# EAGLE board 8BIT_LOGIC_2 (EAGLE 6.5.0), part 1 of 2
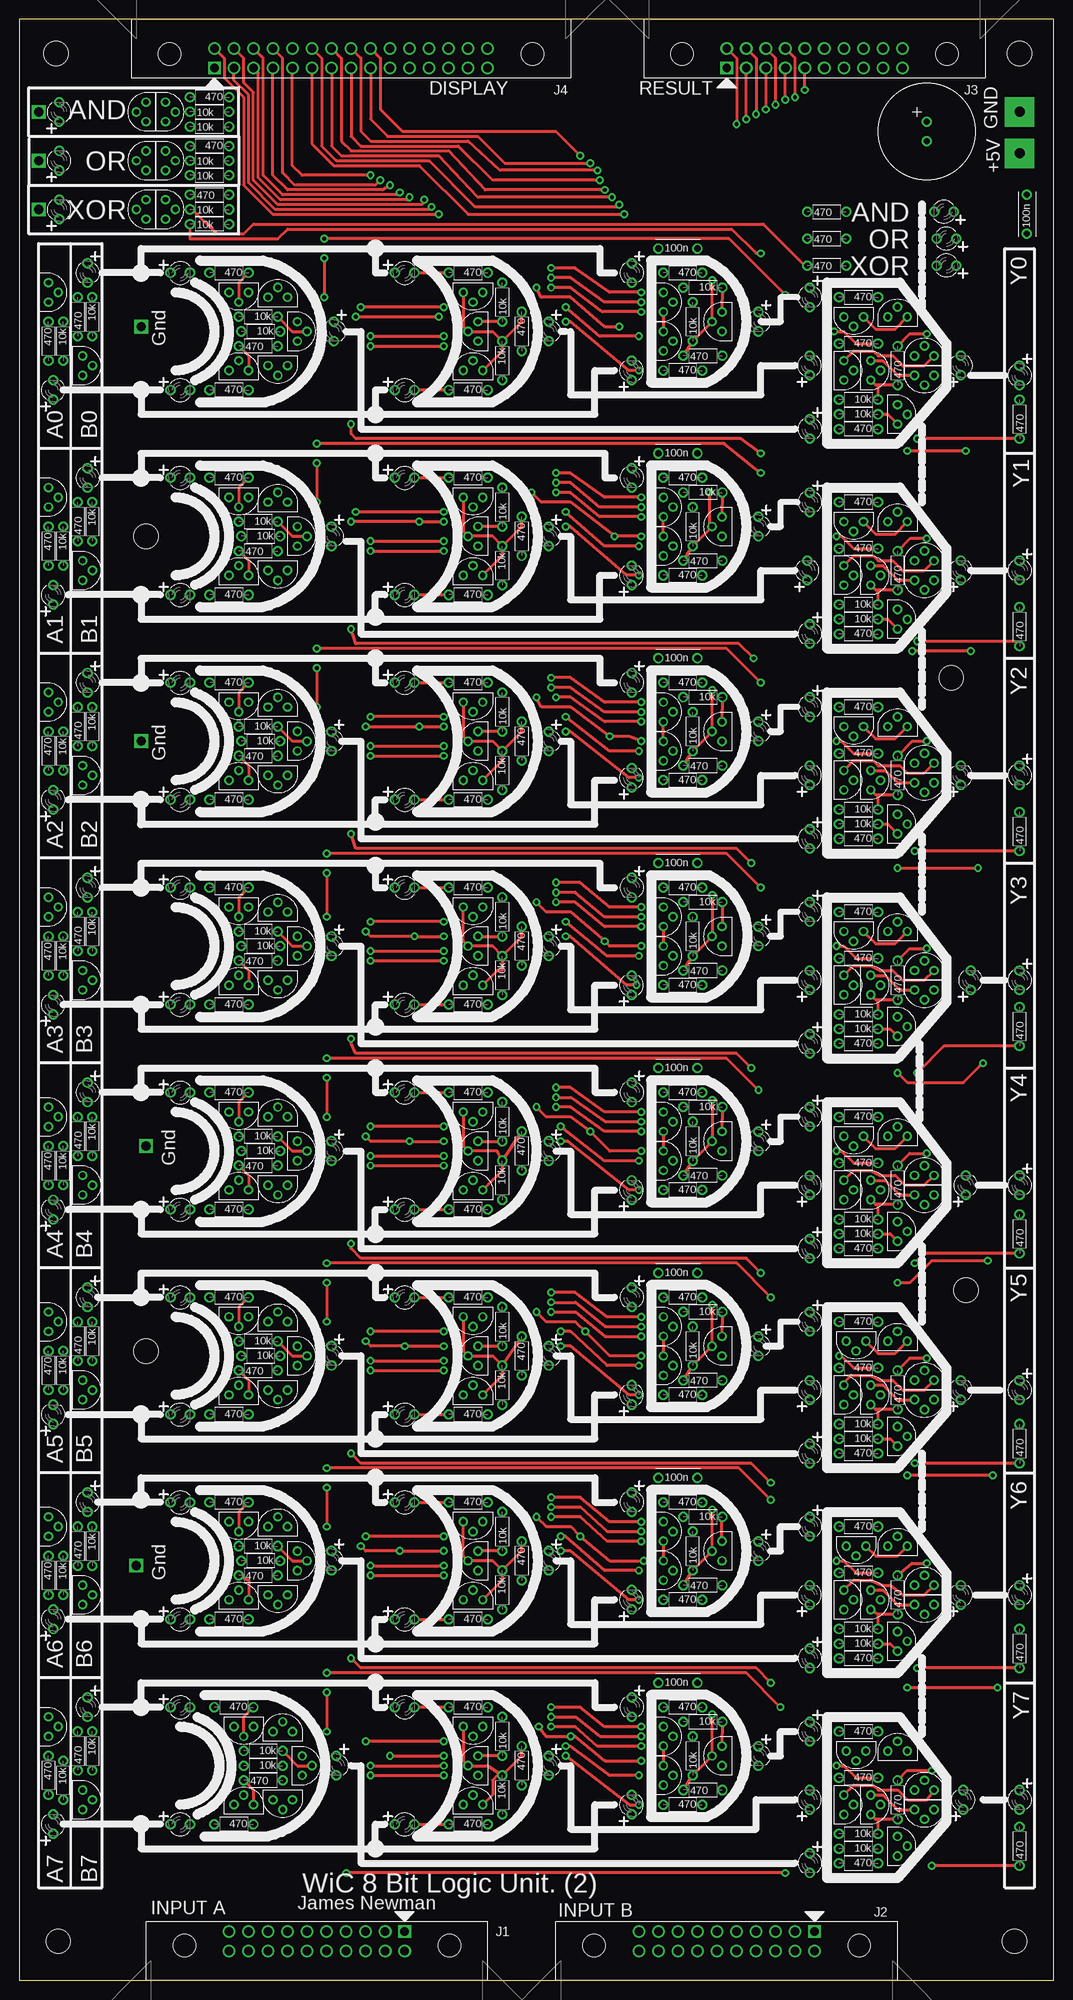
[diagram p16: board, top side]
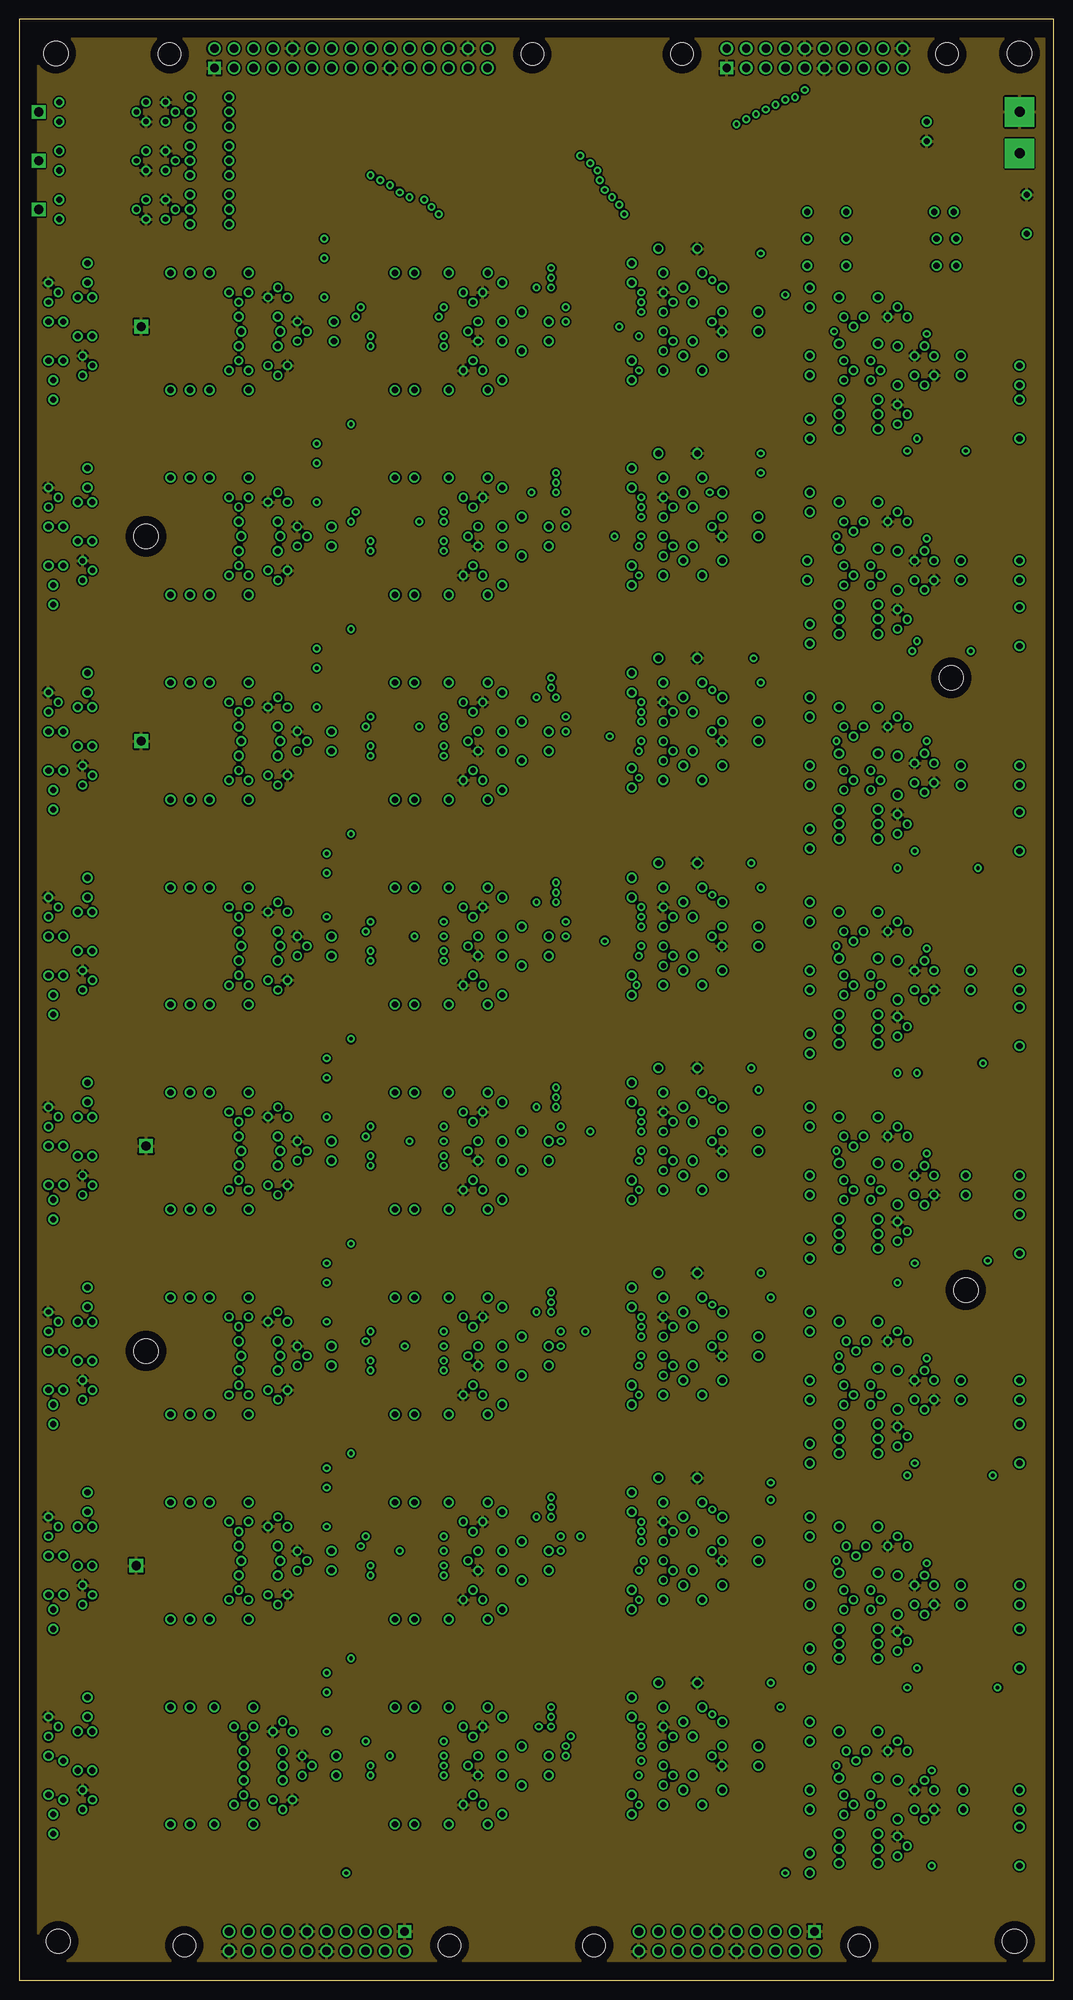
[diagram p17: board, inner layer Route2]
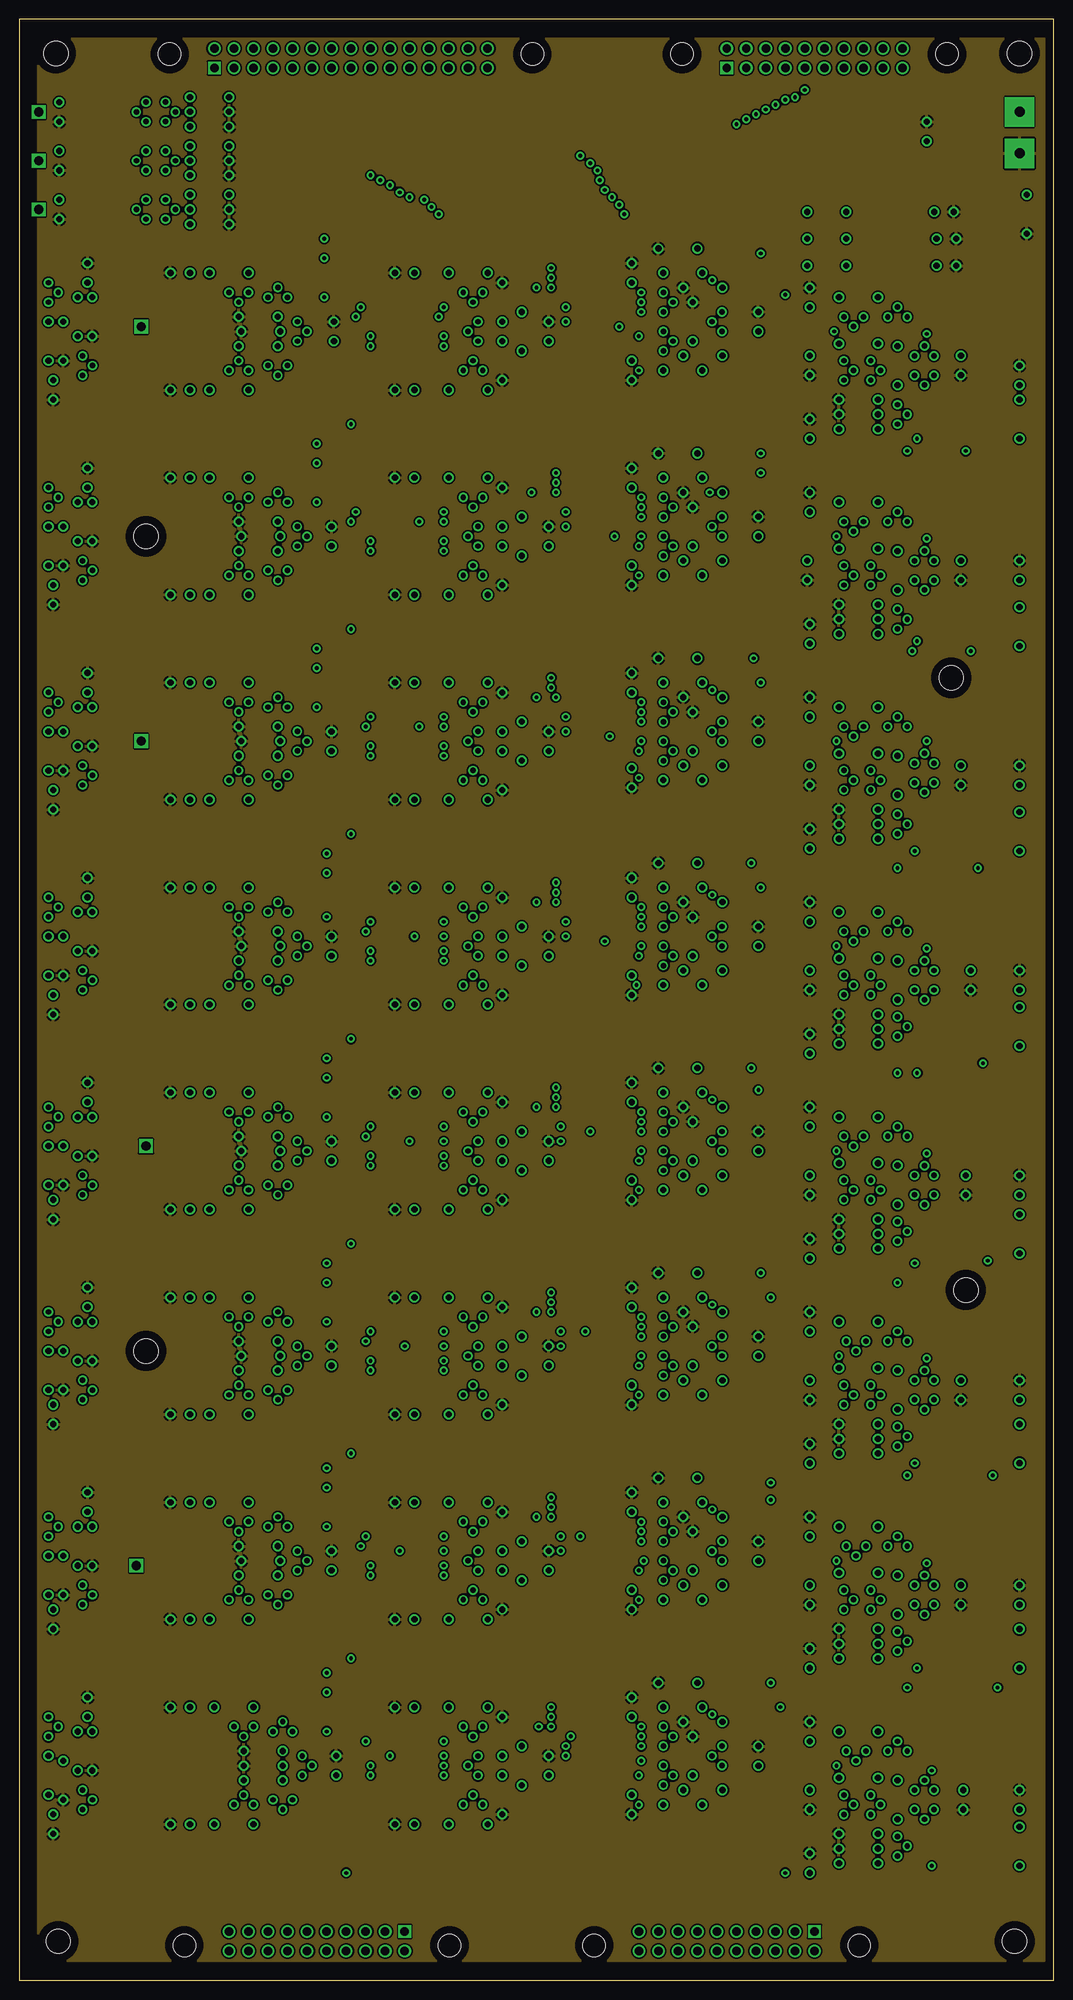
[diagram p18: board, inner layer Route3]
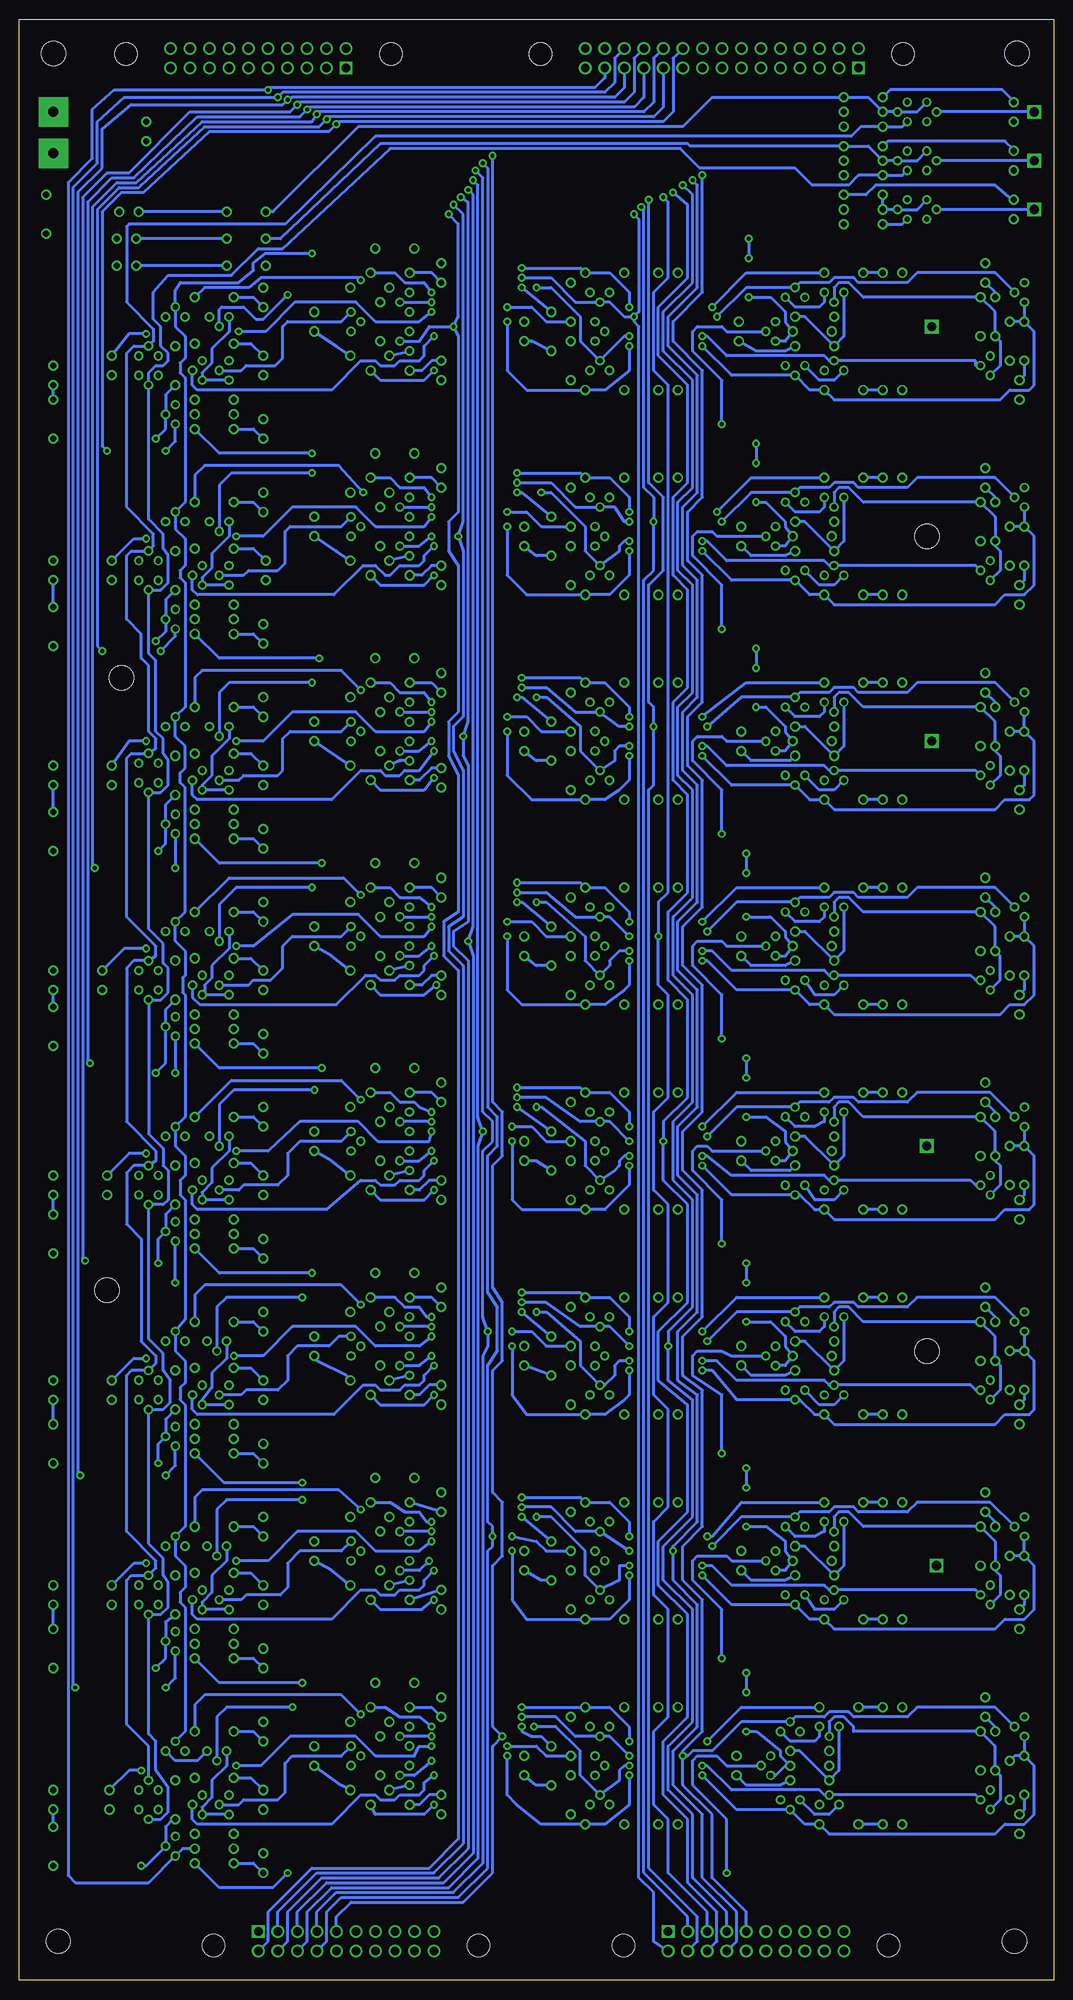
[diagram p19: board, bottom side, seen from below]

Size 134.62 x 255.27 mm. Coordinates in mm from the lower left corner, seen from the top.
Outline: 0,0 134.62,0 134.62,255.27 0,255.27 0,0
Copper layers (1*2+3*16): Top 0.035mm / dielectric 0.2mm / Route2 0.035mm / dielectric 1mm / Route3 0.035mm / dielectric 0.2mm / Bottom 0.035mm
Design rules "processor_rules_4layer": minimum track width 10mil, minimum drill 0.0236mm, track to track 8mil, track to pad 8mil, pad to pad 8mil, via to via 8mil, smd to smd 8mil, copper to edge 40mil, drill to drill 8mil, minimum pad ring 10mil, minimum via ring 8mil, stop-mask expansion 4mil, vias tented up to drill 0.7mm, thermal gap 10mil

## Footprints (pad centres in the part's own frame; a part is rotated, then mirrored left to right if it is on the bottom)
CAP_P2INCH = drill 0.8: 1 -2.54,0; 2 2.54,0
POLARISED_CAP_2P5 = drill 0.8: A 1.27,0; K -1.27,0
LED3MM = drill 0.8: A -1.27,0; K 1.27,0
3M_HOLE = hole 3.2: 0,0
20_HDR_LOCKING_RA = drill 1.1 square: 1 -11.43,-1.27 | drill 1.1: 2 -11.43,1.27; 3 -8.89,-1.27; 4 -8.89,1.27; 5 -6.35,-1.27; 6 -6.35,1.27; 7 -3.81,-1.27; 8 -3.81,1.27; 9 -1.27,-1.27; 10 -1.27,1.27; 11 1.27,-1.27; 12 1.27,1.27; 13 3.81,-1.27; 14 3.81,1.27; 15 6.35,-1.27; 16 6.35,1.27; 17 8.89,-1.27; 18 8.89,1.27; 19 11.43,-1.27; 20 11.43,1.27 | hole 2.946: -17.247,0.533; 17.247,0.533
30_HDR_LOCKING_RA = drill 1.1 square: 1 -17.78,-1.27 | drill 1.1: 2 -17.78,1.27; 3 -15.24,-1.27; 4 -15.24,1.27; 5 -12.7,-1.27; 6 -12.7,1.27; 7 -10.16,-1.27; 8 -10.16,1.27; 9 -7.62,-1.27; 10 -7.62,1.27; 11 -5.08,-1.27; 12 -5.08,1.27; 13 -2.54,-1.27; 14 -2.54,1.27; 15 0,-1.27; 16 0,1.27; 17 2.54,-1.27; 18 2.54,1.27; 19 5.08,-1.27; 20 5.08,1.27; 21 7.62,-1.27; 22 7.62,1.27; 23 10.16,-1.27; 24 10.16,1.27; 25 12.7,-1.27; 26 12.7,1.27; 27 15.24,-1.27; 28 15.24,1.27; 29 17.78,-1.27; 30 17.78,1.27 | hole 2.946: -23.597,0.533; 23.597,0.533
POWER_PAD = drill 1.3 pad 3.81 square: 1 0,0
TO92-DGS = drill 0.7: D 0,1.27; G -1.27,0; S 0,-1.27
R_P2INCH = drill 0.8: 1 -2.54,0; 2 2.54,0
TEST_LOOP = drill 1.2 square: P$1 0,0

## Placement (x,y rotation side)
C1  100n  [CAP_P2INCH]  131.13,229.87 90 top
C2  100n  [CAP_P2INCH]  85.72,225.43 0 top
C3  100n  [CAP_P2INCH]  85.72,145.41 0 top
C4  100n  [CAP_P2INCH]  85.72,65.41 0 top
C5  100n  [CAP_P2INCH]  85.72,38.73 0 top
C6  100uF  [POLARISED_CAP_2P5]  118.11,240.66 90 top
C7  100n  [CAP_P2INCH]  85.72,198.75 0 top
C8  100n  [CAP_P2INCH]  85.72,118.75 0 top
C9  100n  [CAP_P2INCH]  85.72,172.09 0 top
C10  100n  [CAP_P2INCH]  85.72,92.08 0 top
D1  L-1334SRT  [LED3MM]  5.21,243.21 90 top
D2  L-1334SRT  [LED3MM]  5.21,230.5 90 top
D3  L-1334SRT  [LED3MM]  5.21,236.85 90 top
D4  L-1334SRT  [LED3MM]  102.87,219.07 270 top
D5  L-1334SRT  [LED3MM]  102.87,192.41 270 top
D6  L-1334SRT  [LED3MM]  102.87,165.74 270 top
D7  L-1334SRT  [LED3MM]  102.87,139.06 270 top
D8  L-1334SRT  [LED3MM]  102.87,112.39 270 top
D9  L-1334SRT  [LED3MM]  102.87,85.72 270 top
D10  L-1334SRT  [LED3MM]  102.87,59.05 270 top
D11  L-1334SRT  [LED3MM]  102.87,32.38 270 top
D12  L-1334SRT  [LED3MM]  102.87,210.19 90 top
D13  L-1334SRT  [LED3MM]  102.55,183.51 90 top
D14  L-1334SRT  [LED3MM]  102.87,156.84 90 top
D15  L-1334SRT  [LED3MM]  102.87,130.18 90 top
D16  L-1334SRT  [LED3MM]  40.96,214.63 270 top
D17  L-1334SRT  [LED3MM]  20.95,222.25 0 top
D18  L-1334SRT  [LED3MM]  20.95,207.01 0 top
D19  L-1334SRT  [LED3MM]  102.87,103.5 90 top
D20  L-1334SRT  [LED3MM]  102.87,76.83 90 top
D21  L-1334SRT  [LED3MM]  102.87,50.16 90 top
D22  L-1334SRT  [LED3MM]  40.64,187.96 270 top
D23  L-1334SRT  [LED3MM]  20.95,195.58 0 top
D24  L-1334SRT  [LED3MM]  20.95,180.34 0 top
D25  L-1334SRT  [LED3MM]  102.87,23.5 90 top
D26  L-1334SRT  [LED3MM]  102.87,201.93 270 top
D27  L-1334SRT  [LED3MM]  102.87,175.26 270 top
D28  L-1334SRT  [LED3MM]  102.87,148.59 270 top
D29  L-1334SRT  [LED3MM]  102.87,121.92 270 top
D30  L-1334SRT  [LED3MM]  102.87,95.25 270 top
D31  L-1334SRT  [LED3MM]  68.9,214.63 270 top
D32  L-1334SRT  [LED3MM]  50.16,222.25 0 top
D33  L-1334SRT  [LED3MM]  50.16,207.01 0 top
D34  L-1334SRT  [LED3MM]  102.87,68.58 270 top
D35  L-1334SRT  [LED3MM]  102.87,41.91 270 top
D36  L-1334SRT  [LED3MM]  102.87,15.24 270 top
D37  L-1334SRT  [LED3MM]  68.9,187.96 270 top
D38  L-1334SRT  [LED3MM]  50.16,195.58 0 top
D39  L-1334SRT  [LED3MM]  50.16,180.34 0 top
D40  L-1334SRT  [LED3MM]  96.2,189.23 270 top
D41  L-1334SRT  [LED3MM]  79.69,195.58 270 top
D42  L-1334SRT  [LED3MM]  79.69,182.88 90 top
D43  L-1334SRT  [LED3MM]  96.2,215.9 270 top
D44  L-1334SRT  [LED3MM]  79.69,222.25 270 top
D45  L-1334SRT  [LED3MM]  79.69,209.55 90 top
D46  L-1334SRT  [LED3MM]  122.56,210.19 90 top
D47  L-1334SRT  [LED3MM]  122.56,183.51 90 top
D48  L-1334SRT  [LED3MM]  122.56,156.84 90 top
D49  L-1334SRT  [LED3MM]  123.83,130.18 90 top
D50  L-1334SRT  [LED3MM]  122.87,23.5 90 top
D51  L-1334SRT  [LED3MM]  122.56,50.16 90 top
D52  L-1334SRT  [LED3MM]  122.56,76.83 90 top
D53  L-1334SRT  [LED3MM]  123.19,103.5 90 top
D54  L-1334SRT  [LED3MM]  120.33,230.19 180 top
D55  L-1334SRT  [LED3MM]  40.64,161.29 270 top
D56  L-1334SRT  [LED3MM]  20.95,168.91 0 top
D57  L-1334SRT  [LED3MM]  20.95,153.67 0 top
D58  L-1334SRT  [LED3MM]  120.65,226.69 180 top
D59  L-1334SRT  [LED3MM]  120.65,223.2 180 top
D61  L-1334SRT  [LED3MM]  40.64,134.62 270 top
D62  L-1334SRT  [LED3MM]  20.95,142.24 0 top
D63  L-1334SRT  [LED3MM]  20.95,127 0 top
D67  L-1334SRT  [LED3MM]  40.64,107.95 270 top
D68  L-1334SRT  [LED3MM]  20.95,115.57 0 top
D69  L-1334SRT  [LED3MM]  20.95,100.33 0 top
D73  L-1334SRT  [LED3MM]  40.64,81.28 270 top
D74  L-1334SRT  [LED3MM]  20.95,88.9 0 top
D75  L-1334SRT  [LED3MM]  20.95,73.66 0 top
D79  L-1334SRT  [LED3MM]  40.64,54.61 270 top
D80  L-1334SRT  [LED3MM]  20.95,62.23 0 top
D81  L-1334SRT  [LED3MM]  20.95,46.99 0 top
D85  L-1334SRT  [LED3MM]  41.27,27.94 270 top
D86  L-1334SRT  [LED3MM]  20.95,35.56 0 top
D87  L-1334SRT  [LED3MM]  20.95,20.32 0 top
D94  L-1334SRT  [LED3MM]  68.9,161.29 270 top
D95  L-1334SRT  [LED3MM]  50.16,168.91 0 top
D96  L-1334SRT  [LED3MM]  50.16,153.67 0 top
D97  L-1334SRT  [LED3MM]  96.2,162.56 270 top
D98  L-1334SRT  [LED3MM]  79.69,168.91 270 top
D99  L-1334SRT  [LED3MM]  79.69,156.53 90 top
D103  L-1334SRT  [LED3MM]  68.9,134.62 270 top
D104  L-1334SRT  [LED3MM]  50.16,142.24 0 top
D105  L-1334SRT  [LED3MM]  50.16,127 0 top
D106  L-1334SRT  [LED3MM]  96.2,135.89 270 top
D107  L-1334SRT  [LED3MM]  79.69,142.24 270 top
D108  L-1334SRT  [LED3MM]  79.69,129.54 90 top
D112  L-1334SRT  [LED3MM]  68.9,107.95 270 top
D113  L-1334SRT  [LED3MM]  50.16,115.57 0 top
D114  L-1334SRT  [LED3MM]  50.16,100.33 0 top
D115  L-1334SRT  [LED3MM]  96.2,109.22 270 top
D116  L-1334SRT  [LED3MM]  79.69,115.57 270 top
D117  L-1334SRT  [LED3MM]  79.69,102.87 90 top
D121  L-1334SRT  [LED3MM]  68.9,81.28 270 top
D122  L-1334SRT  [LED3MM]  50.16,88.9 0 top
D123  L-1334SRT  [LED3MM]  50.16,73.66 0 top
D124  L-1334SRT  [LED3MM]  96.2,82.55 270 top
D125  L-1334SRT  [LED3MM]  79.69,88.9 270 top
D126  L-1334SRT  [LED3MM]  79.69,76.2 90 top
D130  L-1334SRT  [LED3MM]  68.9,54.61 270 top
D131  L-1334SRT  [LED3MM]  50.16,62.23 0 top
D132  L-1334SRT  [LED3MM]  50.16,46.99 0 top
D133  L-1334SRT  [LED3MM]  96.2,55.88 270 top
D134  L-1334SRT  [LED3MM]  79.69,62.23 270 top
D135  L-1334SRT  [LED3MM]  79.69,49.53 90 top
D139  L-1334SRT  [LED3MM]  68.9,27.94 270 top
D140  L-1334SRT  [LED3MM]  50.16,35.56 0 top
D141  L-1334SRT  [LED3MM]  50.16,20.32 0 top
D142  L-1334SRT  [LED3MM]  96.2,29.21 270 top
D143  L-1334SRT  [LED3MM]  79.69,35.56 270 top
D144  L-1334SRT  [LED3MM]  79.69,22.86 90 top
D145  L-1334SRT  [LED3MM]  8.89,142.24 270 top
D146  L-1334SRT  [LED3MM]  8.89,168.91 270 top
D147  L-1334SRT  [LED3MM]  8.89,195.58 270 top
D148  L-1334SRT  [LED3MM]  8.89,222.25 270 top
D149  L-1334SRT  [LED3MM]  4.45,153.67 90 top
D150  L-1334SRT  [LED3MM]  8.89,115.57 270 top
D151  L-1334SRT  [LED3MM]  8.89,88.9 270 top
D152  L-1334SRT  [LED3MM]  8.89,62.23 270 top
D153  L-1334SRT  [LED3MM]  8.89,35.56 270 top
D155  L-1334SRT  [LED3MM]  4.45,207.01 90 top
D156  L-1334SRT  [LED3MM]  4.45,180.34 90 top
D157  L-1334SRT  [LED3MM]  4.45,100.33 90 top
D158  L-1334SRT  [LED3MM]  4.45,127 90 top
D159  L-1334SRT  [LED3MM]  4.45,73.66 90 top
D160  L-1334SRT  [LED3MM]  4.45,46.99 90 top
D161  L-1334SRT  [LED3MM]  4.45,20.32 90 top
D163  L-1334SRT  [LED3MM]  130.18,208.91 270 top
D164  L-1334SRT  [LED3MM]  130.18,183.51 270 top
D165  L-1334SRT  [LED3MM]  130.18,156.84 270 top
D166  L-1334SRT  [LED3MM]  130.18,130.18 270 top
D167  L-1334SRT  [LED3MM]  130.18,103.5 270 top
D168  L-1334SRT  [LED3MM]  130.18,76.83 270 top
D169  L-1334SRT  [LED3MM]  130.18,50.16 270 top
D170  L-1334SRT  [LED3MM]  130.18,23.5 270 top
H1  3M_MOUNT_HOLE  [3M_HOLE]  121.28,169.54 0 top
H2  3M_MOUNT_HOLE  [3M_HOLE]  123.19,89.85 0 top
HOLE1  3M_MOUNT_HOLE  [3M_HOLE]  4.76,250.82 0 top
HOLE2  3M_MOUNT_HOLE  [3M_HOLE]  129.54,5.08 0 top
HOLE3  3M_MOUNT_HOLE  [3M_HOLE]  16.51,187.96 0 top
HOLE4  3M_MOUNT_HOLE  [3M_HOLE]  130.18,250.82 0 top
HOLE5  3M_MOUNT_HOLE  [3M_HOLE]  16.51,81.92 0 top
HOLE6  3M_MOUNT_HOLE  [3M_HOLE]  5.08,5.08 0 top
J1  20_HDR_LOCKING_RA  [20_HDR_LOCKING_RA]  38.73,5.08 180 top
J2  20_HDR_LOCKING_RA  [20_HDR_LOCKING_RA]  92.08,5.08 180 top
J3  20_HDR_LOCKING_RA  [20_HDR_LOCKING_RA]  103.5,250.19 0 top
J4  30_HDR_LOCKING_RA  [30_HDR_LOCKING_RA]  43.18,250.19 0 top
PP1  POWER_PAD  [POWER_PAD]  130.18,237.81 90 top
PP2  POWER_PAD  [POWER_PAD]  130.18,243.21 90 top
Q1  2N7000  [TO92-DGS]  16.51,230.5 0 top
Q2  2N7000  [TO92-DGS]  16.51,243.21 0 top
Q3  2N7000  [TO92-DGS]  16.51,236.85 0 top
Q4  2N7000  [TO92-DGS]  117.79,211.46 270 top
Q5  2N7000  [TO92-DGS]  107.31,209.55 180 top
Q6  2N7000  [TO92-DGS]  107.31,182.88 180 top
Q7  2N7000  [TO92-DGS]  107.31,156.21 180 top
Q8  2N7000  [TO92-DGS]  107.31,129.54 180 top
Q9  2N7000  [TO92-DGS]  107.31,102.87 180 top
Q10  2N7000  [TO92-DGS]  107.31,76.2 180 top
Q11  2N7000  [TO92-DGS]  107.31,49.53 180 top
Q12  2N7000  [TO92-DGS]  107.31,22.86 180 top
Q13  2N7000  [TO92-DGS]  117.79,208.91 90 top
Q14  2N7000  [TO92-DGS]  110.81,209.55 180 top
Q15  2N7000  [TO92-DGS]  110.81,182.88 180 top
Q16  2N7000  [TO92-DGS]  110.81,156.21 180 top
Q17  2N7000  [TO92-DGS]  110.81,129.54 180 top
Q18  2N7000  [TO92-DGS]  110.81,102.87 180 top
Q19  2N7000  [TO92-DGS]  110.81,76.2 180 top
Q20  2N7000  [TO92-DGS]  110.81,49.53 180 top
Q21  2N7000  [TO92-DGS]  110.81,22.86 180 top
Q22  2N7000  [TO92-DGS]  28.57,209.55 270 top
Q23  2N7000  [TO92-DGS]  33.66,210.19 90 top
Q24  2N7000  [TO92-DGS]  28.57,219.71 90 top
Q25  2N7000  [TO92-DGS]  33.66,219.07 270 top
Q26  2N7000  [TO92-DGS]  36.2,214.63 180 top
Q27  2N7000  [TO92-DGS]  114.3,216.53 270 top
Q28  2N7000  [TO92-DGS]  108.58,216.53 90 top
Q29  2N7000  [TO92-DGS]  108.58,189.87 90 top
Q30  2N7000  [TO92-DGS]  108.58,163.19 90 top
Q31  2N7000  [TO92-DGS]  108.58,136.53 90 top
Q32  2N7000  [TO92-DGS]  28.57,182.88 270 top
Q33  2N7000  [TO92-DGS]  33.66,183.51 90 top
Q34  2N7000  [TO92-DGS]  28.57,193.04 90 top
Q35  2N7000  [TO92-DGS]  33.66,192.41 270 top
Q36  2N7000  [TO92-DGS]  36.2,187.96 180 top
Q37  2N7000  [TO92-DGS]  108.58,109.86 90 top
Q38  2N7000  [TO92-DGS]  108.9,83.19 90 top
Q39  2N7000  [TO92-DGS]  108.9,56.52 90 top
Q40  2N7000  [TO92-DGS]  108.9,29.84 90 top
Q41  2N7000  [TO92-DGS]  114.3,203.84 180 top
Q42  2N7000  [TO92-DGS]  114.3,177.16 180 top
Q43  2N7000  [TO92-DGS]  114.3,150.5 180 top
Q44  2N7000  [TO92-DGS]  114.3,124.14 180 top
Q45  2N7000  [TO92-DGS]  59.05,209.55 270 top
Q46  2N7000  [TO92-DGS]  59.05,219.71 90 top
Q47  2N7000  [TO92-DGS]  59.69,214.63 0 top
Q48  2N7000  [TO92-DGS]  114.3,17.46 180 top
Q49  2N7000  [TO92-DGS]  114.3,44.13 180 top
Q50  2N7000  [TO92-DGS]  114.3,70.8 180 top
Q51  2N7000  [TO92-DGS]  59.05,182.88 270 top
Q52  2N7000  [TO92-DGS]  59.05,193.04 90 top
Q53  2N7000  [TO92-DGS]  59.69,187.96 0 top
Q54  2N7000  [TO92-DGS]  83.82,186.69 180 top
Q55  2N7000  [TO92-DGS]  83.82,191.77 180 top
Q56  2N7000  [TO92-DGS]  91.44,189.23 0 top
Q57  2N7000  [TO92-DGS]  83.82,213.36 180 top
Q58  2N7000  [TO92-DGS]  83.82,218.44 180 top
Q59  2N7000  [TO92-DGS]  91.44,215.9 0 top
Q60  2N7000  [TO92-DGS]  114.3,97.47 180 top
Q61  2N7000  [TO92-DGS]  19.05,243.21 180 top
Q62  2N7000  [TO92-DGS]  19.05,236.85 180 top
Q63  2N7000  [TO92-DGS]  19.05,230.5 180 top
Q64  2N7000  [TO92-DGS]  117.79,24.77 270 top
Q65  2N7000  [TO92-DGS]  114.3,29.84 270 top
Q66  2N7000  [TO92-DGS]  117.79,22.23 90 top
Q67  2N7000  [TO92-DGS]  117.79,48.9 90 top
Q68  2N7000  [TO92-DGS]  117.79,75.56 90 top
Q69  2N7000  [TO92-DGS]  117.79,102.23 90 top
Q70  2N7000  [TO92-DGS]  117.79,128.91 90 top
Q71  2N7000  [TO92-DGS]  117.79,155.89 90 top
Q72  2N7000  [TO92-DGS]  117.79,182.25 90 top
Q73  2N7000  [TO92-DGS]  114.3,189.87 270 top
Q74  2N7000  [TO92-DGS]  114.3,163.19 270 top
Q75  2N7000  [TO92-DGS]  114.3,136.53 270 top
Q76  2N7000  [TO92-DGS]  114.3,109.86 270 top
Q77  2N7000  [TO92-DGS]  114.3,83.19 270 top
Q78  2N7000  [TO92-DGS]  114.3,56.52 270 top
Q79  2N7000  [TO92-DGS]  28.57,156.21 270 top
Q80  2N7000  [TO92-DGS]  33.66,156.84 90 top
Q81  2N7000  [TO92-DGS]  28.57,166.37 90 top
Q82  2N7000  [TO92-DGS]  33.66,165.74 270 top
Q83  2N7000  [TO92-DGS]  36.2,161.29 180 top
Q84  2N7000  [TO92-DGS]  117.79,184.78 270 top
Q85  2N7000  [TO92-DGS]  117.79,158.43 270 top
Q86  2N7000  [TO92-DGS]  117.79,131.44 270 top
Q87  2N7000  [TO92-DGS]  117.79,104.78 270 top
Q88  2N7000  [TO92-DGS]  117.79,78.11 270 top
Q89  2N7000  [TO92-DGS]  28.57,129.54 270 top
Q90  2N7000  [TO92-DGS]  33.66,130.18 90 top
Q91  2N7000  [TO92-DGS]  28.57,139.7 90 top
Q92  2N7000  [TO92-DGS]  33.66,139.06 270 top
Q93  2N7000  [TO92-DGS]  36.2,134.62 180 top
Q94  2N7000  [TO92-DGS]  117.79,51.44 270 top
Q99  2N7000  [TO92-DGS]  28.57,102.87 270 top
Q100  2N7000  [TO92-DGS]  33.66,103.5 90 top
Q101  2N7000  [TO92-DGS]  28.57,113.03 90 top
Q102  2N7000  [TO92-DGS]  33.66,112.39 270 top
Q103  2N7000  [TO92-DGS]  36.2,107.95 180 top
Q109  2N7000  [TO92-DGS]  28.57,76.2 270 top
Q110  2N7000  [TO92-DGS]  33.66,76.83 90 top
Q111  2N7000  [TO92-DGS]  28.57,86.36 90 top
Q112  2N7000  [TO92-DGS]  33.66,85.72 270 top
Q113  2N7000  [TO92-DGS]  36.2,81.28 180 top
Q119  2N7000  [TO92-DGS]  28.57,49.53 270 top
Q120  2N7000  [TO92-DGS]  33.66,50.16 90 top
Q121  2N7000  [TO92-DGS]  28.57,59.69 90 top
Q122  2N7000  [TO92-DGS]  33.66,59.05 270 top
Q123  2N7000  [TO92-DGS]  36.2,54.61 180 top
Q129  2N7000  [TO92-DGS]  29.21,22.86 270 top
Q130  2N7000  [TO92-DGS]  34.29,23.5 90 top
Q131  2N7000  [TO92-DGS]  29.21,33.02 90 top
Q132  2N7000  [TO92-DGS]  34.29,32.38 270 top
Q133  2N7000  [TO92-DGS]  36.83,27.94 180 top
Q142  2N7000  [TO92-DGS]  59.05,156.21 270 top
Q143  2N7000  [TO92-DGS]  59.05,166.37 90 top
Q144  2N7000  [TO92-DGS]  59.69,161.29 0 top
Q145  2N7000  [TO92-DGS]  83.82,160.02 180 top
Q146  2N7000  [TO92-DGS]  83.82,165.1 180 top
Q147  2N7000  [TO92-DGS]  91.44,162.56 0 top
Q151  2N7000  [TO92-DGS]  59.05,129.54 270 top
Q152  2N7000  [TO92-DGS]  59.05,139.7 90 top
Q153  2N7000  [TO92-DGS]  59.69,134.62 0 top
Q154  2N7000  [TO92-DGS]  83.82,133.35 180 top
Q155  2N7000  [TO92-DGS]  83.82,138.43 180 top
Q156  2N7000  [TO92-DGS]  91.44,135.89 0 top
Q160  2N7000  [TO92-DGS]  59.05,102.87 270 top
Q161  2N7000  [TO92-DGS]  59.05,113.03 90 top
Q162  2N7000  [TO92-DGS]  59.69,107.95 0 top
Q163  2N7000  [TO92-DGS]  83.82,106.68 180 top
Q164  2N7000  [TO92-DGS]  83.82,111.76 180 top
Q165  2N7000  [TO92-DGS]  91.44,109.22 0 top
Q169  2N7000  [TO92-DGS]  59.05,76.2 270 top
Q170  2N7000  [TO92-DGS]  59.05,86.36 90 top
Q171  2N7000  [TO92-DGS]  59.69,81.28 0 top
Q172  2N7000  [TO92-DGS]  83.82,80.01 180 top
Q173  2N7000  [TO92-DGS]  83.82,85.09 180 top
Q174  2N7000  [TO92-DGS]  91.44,82.55 0 top
Q178  2N7000  [TO92-DGS]  59.05,49.53 270 top
Q179  2N7000  [TO92-DGS]  59.05,59.69 90 top
Q180  2N7000  [TO92-DGS]  59.69,54.61 0 top
Q181  2N7000  [TO92-DGS]  83.82,53.34 180 top
Q182  2N7000  [TO92-DGS]  83.82,58.42 180 top
Q183  2N7000  [TO92-DGS]  91.44,55.88 0 top
Q187  2N7000  [TO92-DGS]  59.05,22.86 270 top
Q188  2N7000  [TO92-DGS]  59.05,33.02 90 top
Q189  2N7000  [TO92-DGS]  59.69,27.94 0 top
Q190  2N7000  [TO92-DGS]  83.82,26.67 180 top
Q191  2N7000  [TO92-DGS]  83.82,31.75 180 top
Q192  2N7000  [TO92-DGS]  91.44,29.21 0 top
Q193  2N7000  [TO92-DGS]  3.81,219.71 180 top
Q194  2N7000  [TO92-DGS]  3.81,193.04 180 top
Q195  2N7000  [TO92-DGS]  3.81,166.37 180 top
Q196  2N7000  [TO92-DGS]  3.81,139.7 180 top
Q197  2N7000  [TO92-DGS]  3.81,112.39 180 top
Q198  2N7000  [TO92-DGS]  3.81,85.72 180 top
Q199  2N7000  [TO92-DGS]  3.81,59.05 180 top
Q200  2N7000  [TO92-DGS]  3.81,33.02 180 top
Q201  2N7000  [TO92-DGS]  8.26,210.19 180 top
Q202  2N7000  [TO92-DGS]  8.26,183.51 180 top
Q203  2N7000  [TO92-DGS]  8.26,156.84 180 top
Q204  2N7000  [TO92-DGS]  8.26,130.18 180 top
Q205  2N7000  [TO92-DGS]  8.26,103.5 180 top
Q206  2N7000  [TO92-DGS]  8.26,76.83 180 top
Q207  2N7000  [TO92-DGS]  8.26,50.16 180 top
Q208  2N7000  [TO92-DGS]  8.26,23.5 180 top
R1  10k  [R_P2INCH]  24.77,230.5 0 top
R2  10k  [R_P2INCH]  24.77,243.21 0 top
R3  470  [R_P2INCH]  24.77,245.11 180 top
R4  470  [R_P2INCH]  24.77,232.41 0 top
R5  10k  [R_P2INCH]  24.77,236.85 0 top
R6  470  [R_P2INCH]  24.77,238.76 180 top
R7  10k  [R_P2INCH]  109.22,205.74 180 top
R9  10k  [R_P2INCH]  109.22,179.07 180 top
R10  10k  [R_P2INCH]  109.22,152.4 180 top
R11  10k  [R_P2INCH]  109.22,125.73 180 top
R12  10k  [R_P2INCH]  109.22,99.06 180 top
R13  10k  [R_P2INCH]  109.22,72.39 180 top
R14  10k  [R_P2INCH]  109.22,45.72 180 top
R15  10k  [R_P2INCH]  109.22,19.05 180 top
R16  470  [R_P2INCH]  109.22,219.07 180 top
R17  470  [R_P2INCH]  109.22,192.41 180 top
R18  470  [R_P2INCH]  109.22,165.74 180 top
R19  470  [R_P2INCH]  109.22,139.06 180 top
R20  470  [R_P2INCH]  109.22,112.39 180 top
R21  470  [R_P2INCH]  109.22,85.72 180 top
R22  470  [R_P2INCH]  109.22,59.05 180 top
R23  470  [R_P2INCH]  109.22,32.38 180 top
R26  10k  [R_P2INCH]  31.11,216.53 180 top
R27  470  [R_P2INCH]  31.11,212.72 0 top
R28  10k  [R_P2INCH]  31.43,214.63 180 top
R29  470  [R_P2INCH]  27.3,222.25 180 top
R30  470  [R_P2INCH]  27.3,207.01 180 top
R31  470  [R_P2INCH]  105.09,230.19 0 top
R32  470  [R_P2INCH]  105.09,226.69 0 top
R33  470  [R_P2INCH]  105.09,223.2 0 top
R34  10k  [R_P2INCH]  24.77,241.3 0 top
R35  10k  [R_P2INCH]  24.77,234.95 0 top
R36  10k  [R_P2INCH]  31.11,189.87 180 top
R37  470  [R_P2INCH]  31.11,186.06 0 top
R38  10k  [R_P2INCH]  31.43,187.96 180 top
R39  470  [R_P2INCH]  27.3,195.58 180 top
R40  470  [R_P2INCH]  27.3,180.34 180 top
R41  10k  [R_P2INCH]  24.77,228.6 0 top
R43  470  [R_P2INCH]  109.22,213.04 180 top
R44  470  [R_P2INCH]  109.22,186.37 180 top
R45  470  [R_P2INCH]  109.22,159.7 180 top
R46  470  [R_P2INCH]  109.22,133.03 180 top
R47  470  [R_P2INCH]  109.22,106.36 180 top
R48  470  [R_P2INCH]  109.22,79.69 180 top
R49  470  [R_P2INCH]  109.22,53.02 180 top
R50  470  [R_P2INCH]  109.22,26.35 180 top
R51  10k  [R_P2INCH]  62.87,210.82 270 top
R52  470  [R_P2INCH]  65.41,214.63 270 top
R53  10k  [R_P2INCH]  62.87,218.44 90 top
R54  470  [R_P2INCH]  58.42,222.25 180 top
R55  470  [R_P2INCH]  58.42,207.01 180 top
R61  10k  [R_P2INCH]  62.87,184.15 270 top
R62  470  [R_P2INCH]  65.41,187.96 270 top
R63  10k  [R_P2INCH]  62.87,191.77 90 top
R64  470  [R_P2INCH]  58.42,195.58 180 top
R65  470  [R_P2INCH]  58.42,180.34 180 top
R66  10k  [R_P2INCH]  87.63,189.23 90 top
R67  470  [R_P2INCH]  88.98,184.78 0 top
R68  10k  [R_P2INCH]  88.98,193.68 180 top
R69  470  [R_P2INCH]  86.36,195.58 180 top
R70  470  [R_P2INCH]  86.36,182.88 180 top
R71  10k  [R_P2INCH]  87.63,215.9 90 top
R72  470  [R_P2INCH]  88.98,211.46 0 top
R73  10k  [R_P2INCH]  88.98,220.34 180 top
R74  470  [R_P2INCH]  86.36,222.25 180 top
R75  470  [R_P2INCH]  86.36,209.55 180 top
R80  470  [R_P2INCH]  109.22,201.93 180 top
R81  470  [R_P2INCH]  109.22,175.26 180 top
R82  470  [R_P2INCH]  109.22,148.59 180 top
R83  470  [R_P2INCH]  109.22,121.92 180 top
R84  470  [R_P2INCH]  109.22,95.25 180 top
R85  470  [R_P2INCH]  109.22,68.58 180 top
R86  470  [R_P2INCH]  109.22,41.91 180 top
R87  470  [R_P2INCH]  109.22,15.24 180 top
R88  470  [R_P2INCH]  114.3,210.19 90 top
R89  10k  [R_P2INCH]  109.22,203.84 180 top
R90  470  [R_P2INCH]  114.3,183.51 90 top
R91  10k  [R_P2INCH]  31.11,163.19 180 top
R92  470  [R_P2INCH]  31.11,159.38 0 top
R93  10k  [R_P2INCH]  31.43,161.29 180 top
R94  470  [R_P2INCH]  27.3,168.91 180 top
R95  470  [R_P2INCH]  27.3,153.67 180 top
R96  10k  [R_P2INCH]  109.22,177.16 180 top
R97  470  [R_P2INCH]  114.3,156.84 90 top
R98  10k  [R_P2INCH]  109.22,150.5 180 top
R99  470  [R_P2INCH]  114.3,130.18 90 top
R100  10k  [R_P2INCH]  109.22,123.83 180 top
R101  10k  [R_P2INCH]  31.11,136.53 180 top
R102  470  [R_P2INCH]  31.11,132.72 0 top
R103  10k  [R_P2INCH]  31.43,134.62 180 top
R104  470  [R_P2INCH]  27.3,142.24 180 top
R105  470  [R_P2INCH]  27.3,127 180 top
R106  470  [R_P2INCH]  114.3,23.5 90 top
R107  10k  [R_P2INCH]  109.22,17.14 180 top
R108  470  [R_P2INCH]  114.3,50.16 90 top
R109  10k  [R_P2INCH]  109.22,43.81 180 top
R110  470  [R_P2INCH]  114.3,76.83 90 top
R111  10k  [R_P2INCH]  31.11,109.86 180 top
R112  470  [R_P2INCH]  31.11,106.05 0 top
R113  10k  [R_P2INCH]  31.43,107.95 180 top
R114  470  [R_P2INCH]  27.3,115.57 180 top
R115  470  [R_P2INCH]  27.3,100.33 180 top
R116  10k  [R_P2INCH]  109.22,70.48 180 top
R117  470  [R_P2INCH]  114.3,103.5 90 top
R118  10k  [R_P2INCH]  109.22,97.16 180 top
R121  10k  [R_P2INCH]  31.11,83.19 180 top
R122  470  [R_P2INCH]  31.11,79.38 0 top
R123  10k  [R_P2INCH]  31.43,81.28 180 top
R124  470  [R_P2INCH]  27.3,88.9 180 top
R125  470  [R_P2INCH]  27.3,73.66 180 top
R131  10k  [R_P2INCH]  31.11,56.52 180 top
R132  470  [R_P2INCH]  31.11,52.7 0 top
R133  10k  [R_P2INCH]  31.43,54.61 180 top
R134  470  [R_P2INCH]  27.3,62.23 180 top
R135  470  [R_P2INCH]  27.3,46.99 180 top
R141  10k  [R_P2INCH]  31.75,29.84 180 top
R142  470  [R_P2INCH]  31.75,26.04 0 top
R143  10k  [R_P2INCH]  31.75,27.94 180 top
R144  470  [R_P2INCH]  27.94,35.56 180 top
R145  470  [R_P2INCH]  27.94,20.32 180 top
R156  10k  [R_P2INCH]  62.87,157.48 270 top
R157  470  [R_P2INCH]  65.41,161.29 270 top
R158  10k  [R_P2INCH]  62.87,165.1 90 top
R159  470  [R_P2INCH]  58.42,168.91 180 top
R160  470  [R_P2INCH]  58.42,153.67 180 top
R161  10k  [R_P2INCH]  87.63,162.56 90 top
R162  470  [R_P2INCH]  88.98,158.12 0 top
R163  10k  [R_P2INCH]  88.98,167 180 top
R164  470  [R_P2INCH]  86.36,168.91 180 top
R165  470  [R_P2INCH]  86.36,156.21 180 top
R171  10k  [R_P2INCH]  62.87,130.81 270 top
R172  470  [R_P2INCH]  65.41,134.62 270 top
R173  10k  [R_P2INCH]  62.87,138.43 90 top
R174  470  [R_P2INCH]  58.42,142.24 180 top
R175  470  [R_P2INCH]  58.42,127 180 top
R176  10k  [R_P2INCH]  87.63,135.89 90 top
R177  470  [R_P2INCH]  88.98,131.44 0 top
R178  10k  [R_P2INCH]  88.98,140.34 180 top
R179  470  [R_P2INCH]  86.36,142.24 180 top
R180  470  [R_P2INCH]  86.36,129.54 180 top
R186  10k  [R_P2INCH]  62.87,104.14 270 top
R187  470  [R_P2INCH]  65.41,107.95 270 top
R188  10k  [R_P2INCH]  62.87,111.76 90 top
R189  470  [R_P2INCH]  58.42,115.57 180 top
R190  470  [R_P2INCH]  58.42,100.33 180 top
R191  10k  [R_P2INCH]  87.63,109.22 90 top
R192  470  [R_P2INCH]  88.98,104.78 0 top
R193  10k  [R_P2INCH]  88.98,113.67 180 top
R194  470  [R_P2INCH]  86.36,115.57 180 top
R195  470  [R_P2INCH]  86.36,102.87 180 top
R201  10k  [R_P2INCH]  62.87,77.47 270 top
R202  470  [R_P2INCH]  65.41,81.28 270 top
R203  10k  [R_P2INCH]  62.87,85.09 90 top
R204  470  [R_P2INCH]  58.42,88.9 180 top
R205  470  [R_P2INCH]  58.42,73.66 180 top
R206  10k  [R_P2INCH]  87.63,82.55 90 top
R207  470  [R_P2INCH]  88.98,78.11 0 top
R208  10k  [R_P2INCH]  88.98,87 180 top
R209  470  [R_P2INCH]  86.36,88.9 180 top
R210  470  [R_P2INCH]  86.36,76.2 180 top
R216  10k  [R_P2INCH]  62.87,50.8 270 top
R217  470  [R_P2INCH]  65.41,54.61 270 top
R218  10k  [R_P2INCH]  62.87,58.42 90 top
R219  470  [R_P2INCH]  58.42,62.23 180 top
R220  470  [R_P2INCH]  58.42,46.99 180 top
R221  10k  [R_P2INCH]  87.63,55.88 90 top
R222  470  [R_P2INCH]  88.98,51.44 0 top
R223  10k  [R_P2INCH]  88.98,60.33 180 top
R224  470  [R_P2INCH]  86.36,62.23 180 top
R225  470  [R_P2INCH]  86.36,49.53 180 top
R231  10k  [R_P2INCH]  62.87,24.13 270 top
R232  470  [R_P2INCH]  65.41,27.94 270 top
R233  10k  [R_P2INCH]  62.87,31.75 90 top
R234  470  [R_P2INCH]  58.42,35.56 180 top
R235  470  [R_P2INCH]  58.42,20.32 180 top
R236  10k  [R_P2INCH]  87.63,29.21 90 top
R237  470  [R_P2INCH]  88.98,24.77 0 top
R238  10k  [R_P2INCH]  88.98,33.66 180 top
R239  470  [R_P2INCH]  86.36,35.56 180 top
R240  470  [R_P2INCH]  86.36,22.86 180 top
R241  10k  [R_P2INCH]  5.71,213.36 270 top
R242  10k  [R_P2INCH]  5.71,186.69 270 top
R243  10k  [R_P2INCH]  5.71,160.02 270 top
R244  10k  [R_P2INCH]  5.71,133.35 270 top
R245  10k  [R_P2INCH]  5.71,106.05 270 top
R246  10k  [R_P2INCH]  5.71,79.38 270 top
R247  10k  [R_P2INCH]  5.71,52.7 270 top
R248  10k  [R_P2INCH]  5.71,26.04 270 top
R249  10k  [R_P2INCH]  9.53,216.53 270 top
R250  10k  [R_P2INCH]  9.53,189.87 270 top
R251  10k  [R_P2INCH]  9.53,163.19 270 top
R252  10k  [R_P2INCH]  9.53,136.53 270 top
R253  10k  [R_P2INCH]  9.53,109.86 270 top
R254  10k  [R_P2INCH]  9.53,83.19 270 top
R255  10k  [R_P2INCH]  9.53,56.52 270 top
R256  10k  [R_P2INCH]  9.53,29.84 270 top
R259  470  [R_P2INCH]  7.62,136.53 90 top
R260  470  [R_P2INCH]  7.62,163.19 90 top
R261  470  [R_P2INCH]  7.62,189.87 90 top
R262  470  [R_P2INCH]  7.62,216.53 90 top
R263  470  [R_P2INCH]  3.81,160.02 270 top
R264  470  [R_P2INCH]  7.62,109.86 90 top
R265  470  [R_P2INCH]  7.62,83.19 90 top
R266  470  [R_P2INCH]  7.62,56.52 90 top
R267  470  [R_P2INCH]  7.62,29.84 90 top
R269  470  [R_P2INCH]  3.81,213.36 270 top
R270  470  [R_P2INCH]  3.81,186.69 270 top
R271  470  [R_P2INCH]  3.81,106.05 270 top
R272  470  [R_P2INCH]  3.81,133.35 270 top
R273  470  [R_P2INCH]  3.81,79.38 270 top
R274  470  [R_P2INCH]  3.81,52.7 270 top
R275  470  [R_P2INCH]  3.81,26.67 270 top
R277  470  [R_P2INCH]  130.18,203.2 90 top
R278  470  [R_P2INCH]  130.18,176.21 90 top
R279  470  [R_P2INCH]  130.18,149.54 90 top
R280  470  [R_P2INCH]  130.18,124.14 90 top
R281  470  [R_P2INCH]  130.18,97.16 90 top
R282  470  [R_P2INCH]  130.18,69.85 90 top
R283  470  [R_P2INCH]  130.18,43.18 90 top
R284  470  [R_P2INCH]  130.18,17.46 90 top
TP1  [TEST_LOOP]  2.54,243.21 0 top
TP2  [TEST_LOOP]  2.54,236.85 0 top
TP3  [TEST_LOOP]  2.54,230.5 0 top
TP4  [TEST_LOOP]  15.88,161.29 90 top
TP5  [TEST_LOOP]  15.88,215.26 90 top
TP6  [TEST_LOOP]  16.51,108.58 90 top
TP7  [TEST_LOOP]  15.24,53.98 90 top

## Tracks (layer width: path | path; a pad name or v marks a point on that pad's centre or on a via)
+5V
  pour Route3: 2.54,252.73 133.35,252.73 133.35,2.54 2.54,2.54
AND0
  Top 0.406: R73.1 Q59.D
  Bottom 0.406: Q5.G 105.73,209.55 105.09,210.19 101.28,210.19 100.33,211.14 100.33,215.26 99.69,215.9 92.71,215.9 Q59.D
AND0_N  (via drill 0.5 pad 1.02)
  Top 0.406: R72.1 R71.1 Q59.G v90.17,221.3
  Bottom 0.406: R72.1 Q57.D | v90.17,221.3 90.49,221.62 103.19,221.62 104.78,220.34 110.49,220.34 R16.1
AND1
  Top 0.406: R68.1 Q56.D
  Bottom 0.406: Q6.G 105.41,182.88 104.78,183.51 100.97,183.51 100.01,184.47 100.01,188.59 99.38,189.23 92.71,189.23 Q56.D
AND1_N  (via drill 0.5 pad 1.02)
  Top 0.406: R67.1 R66.1 Q56.G 89.85,189.55 v89.85,193.68
  Bottom 0.406: Q54.D R67.1 | v89.85,193.68 93.03,197.17 110.49,197.17 111.76,195.9 R17.1
AND2
  Top 0.406: R163.1 Q147.D
  Bottom 0.406: Q7.G 106.05,156.21 105.41,156.84 100.97,156.84 100.33,157.48 100.33,161.61 99.38,162.56 92.71,162.56 Q147.D
AND2_N  (via drill 0.5 pad 1.02)
  Top 0.406: R162.1 R161.1 Q147.G v90.17,167.96
  Bottom 0.406: Q145.D 85.09,158.75 R162.1 | v90.17,167.96 92.71,170.5 110.81,170.5 111.76,169.54 R18.1
AND3
  Top 0.406: R178.1 91.52,137.24 Q156.D
  Bottom 0.406: Q8.G 104.78,129.54 104.14,130.18 101.92,130.18 100.33,131.76 100.33,134.62 99.06,135.89 92.71,135.89 Q156.D
AND3_N  (via drill 0.5 pad 1.02)
  Top 0.406: R177.1 R176.1 Q156.G v90.17,141.29
  Bottom 0.406: Q154.D R177.1 | R19.1 107.31,143.51 92.39,143.51 v90.17,141.29
AND4
  Top 0.406: R193.1 Q165.D
  Bottom 0.406: Q165.D 92.71,109.22 98.11,109.22 99.69,107.63 99.69,104.78 100.97,103.5 105.41,103.5 106.05,102.87 Q9.G
AND4_N  (via drill 0.5 pad 1.02)
  Top 0.406: R192.1 R191.1 Q165.G v90.17,114.62
  Bottom 0.406: Q163.D R192.1 | R20.1 107,117.16 92.71,117.16 v90.17,114.62
AND5
  Top 0.406: R208.1 Q174.D
  Bottom 0.406: Q174.D 93.03,83.82 94.3,82.55 98.42,82.55 99.69,81.28 99.69,78.11 100.97,76.83 105.09,76.83 105.73,76.2 Q10.G
AND5_N  (via drill 0.5 pad 1.02)
  Top 0.406: R207.1 R206.1 Q174.G v90.17,87.95
  Bottom 0.406: Q172.D R207.1 | v90.17,87.95 92.71,90.49 110.49,90.49 111.76,89.22 R21.1
AND6
  Top 0.406: Q183.D 91.44,60.25 R223.1
  Bottom 0.406: Q183.D 92.71,55.88 98.11,55.88 99.69,54.29 99.69,51.12 100.65,50.16 105.09,50.16 105.73,49.53 Q11.G
AND6_N  (via drill 0.5 pad 1.02)
  Top 0.406: R222.1 R221.1 Q183.G v90.17,61.28
  Bottom 0.406: Q181.D R222.1 | v90.17,61.28 93.03,63.82 110.81,63.82 111.76,62.87 R22.1
AND7
  Top 0.406: R238.1 Q192.D
  Bottom 0.406: Q12.G 106.05,22.86 105.41,23.5 100.97,23.5 100.01,24.45 100.01,28.26 99.06,29.21 92.71,29.21 Q192.D
AND7_N  (via drill 0.5 pad 1.02)
  Top 0.406: R237.1 R236.1 Q192.G v90.17,34.61
  Bottom 0.406: Q190.D R237.1 | v90.17,34.61 92.71,37.15 110.49,37.15 111.76,35.88 R23.1
DO_AND
  Bottom 0.406: Q64.G 117.79,30.48 120.65,33.34 120.65,52.07 120.02,52.7 Q94.G 116.84,53.66 116.84,54.61 120.65,58.42 120.65,78.74 120.02,79.38 Q88.G 116.84,80.33 116.84,81.28 118.75,83.19 118.75,96.52 120.65,98.42 120.65,105.09 119.7,106.05 Q87.G 116.84,106.68 116.84,107.95 120.65,111.76 120.65,131.76 119.7,132.72 Q86.G 116.84,133.35 116.84,134.62 120.65,138.43 120.65,159.07 120.02,159.7 Q85.G 116.84,160.34 116.84,161.61 117.79,162.56 117.79,171.13 118.75,172.09 118.75,175.26 120.65,177.16 120.65,185.42 120.02,186.06 Q84.G 117.16,186.69 117.16,188.28 120.65,191.77 120.65,211.77 119.7,212.72 Q4.G 117.16,213.36 117.16,214.95 120.65,218.44 120.65,228.28 120.33,228.6 100.01,228.6 88.27,240.03 26.35,240.03 25.08,241.3 R34.1 19.68,241.3 Q61.D
DO_AND_IN
  Bottom 0.406: TP1.P$1 Q2.G
DO_AND_N
  Bottom 0.406: Q2.D 17.78,243.21 Q61.G R2.1 24.13,245.11 R3.1 44.45,245.11 48.26,241.3 90.49,241.3 101.6,230.19 R31.1
DO_OR
  Bottom 0.406: Q66.G 116.2,20.95 115.25,21.91 115.25,25.08 116.84,27.3 116.84,31.11 117.79,32.07 Q67.G 116.2,47.62 115.25,48.58 115.25,51.75 115.89,52.7 115.89,54.93 117.79,56.83 Q68.G 115.89,74.3 114.94,75.25 114.94,78.11 115.89,79.38 115.89,81.6 117.79,83.5 Q69.G 115.89,100.97 115.25,101.6 115.25,105.41 115.89,106.05 115.89,108.27 117.79,110.17 Q70.G 116.2,127.64 115.25,128.59 115.25,131.76 115.89,132.4 115.89,134.94 117.79,136.84 Q71.G 116.2,154.62 115.25,155.57 115.25,158.75 115.89,159.7 115.89,161.61 116.84,162.56 116.84,171.77 117.79,172.72 Q72.G 116.2,180.97 115.25,181.93 115.25,185.42 115.89,186.37 115.89,188.28 117.79,190.18 Q13.G 117.79,209.23 116.84,210.19 115.89,210.19 115.25,210.82 115.25,211.77 116.2,212.72 116.2,215.26 117.16,216.22 117.16,219.71 115.25,221.93 107,221.93 103.5,225.43 100.33,225.43 86.36,238.44 48.58,238.44 46.04,235.9 33.66,235.9 31.43,233.68 26.67,233.68 25.4,234.95 R35.1 19.68,234.95 Q62.D
DO_OR_IN
  Bottom 0.406: TP2.P$1 Q3.G
DO_OR_N
  Bottom 0.406: Q3.D 17.78,236.85 Q62.G R5.1 24.13,238.76 R6.1 47.31,238.76 47.62,239.08 87.63,239.08 100.65,226.69 R32.1
DO_XOR  (via drill 0.5 pad 1.02)
  Top 0.406: R41.1 22.23,226.69 33.66,226.69 34.92,227.97 92.71,227.97 95.89,224.79 v96.52,224.79
  Bottom 0.406: Q65.G 113.03,32.38 113.03,48.58 113.67,49.21 113.67,50.48 113.03,51.12 113.03,53.98 114.3,55.24 Q78.G 113.03,59.05 113.03,74.93 113.67,75.56 113.67,77.15 113.03,77.79 113.03,80.64 114.3,81.92 Q77.G 113.03,86.04 113.03,101.6 113.67,102.23 113.67,104.14 113.03,104.78 113.03,107.31 114.3,108.58 Q76.G 113.03,112.39 113.03,128.27 113.35,128.59 113.35,130.49 113.03,130.81 113.03,133.99 114.3,135.25 Q75.G 113.03,139.06 113.03,155.26 113.67,155.89 113.67,157.16 113.03,157.8 113.03,160.66 114.3,161.93 Q74.G 113.03,165.74 113.03,181.93 113.67,182.56 113.67,183.51 113.03,184.15 113.03,187.64 114.3,188.91 Q73.G 113.03,192.41 113.03,208.6 113.67,209.23 113.67,210.5 113.03,211.14 113.03,214 114.3,215.26 Q27.G 114.3,220.03 113.67,220.98 106.05,220.98 104.14,222.57 104.14,223.52 102.55,224.79 v96.52,224.79 | R41.1 19.68,228.6 Q63.D
DO_XOR_IN
  Bottom 0.406: TP3.P$1 Q1.G
DO_XOR_N
  Top 0.406: R1.1 22.54,230.5 25.72,227.33 29.21,227.33 30.48,228.6 96.84,228.6 102.23,223.2 R33.1
  Bottom 0.406: R4.1 R1.1 Q63.G 17.78,230.5 Q1.D
GND
  pour Route2: 2.54,252.73 133.35,252.73 133.35,2.54 2.54,2.54
IN_A0  (via drill 0.5 pad 1.02)
  Top 0.406: v43.81,216.53 v54.61,216.53 | v80.96,218.44 76.2,218.44 71.75,221.62 v69.22,221.62 | J4.2 26.67,250.19 26.67,247.65 29.21,245.11 29.21,233.68 33.02,229.87 v54.61,229.87
  Bottom 0.406: Q193.G 7.62,222.25 17.78,222.25 19.05,220.98 25.4,220.98 26.04,221.62 28.57,221.62 29.21,220.98 33.02,220.98 Q25.G 40.01,220.34 v43.81,216.53 | J1.2 52.07,5.08 52.07,11.43 53.98,13.34 53.98,215.26 54.61,215.9 v54.61,216.53 | v54.61,216.53 53.98,217.17 53.98,229.24 v54.61,229.87 | v54.61,216.53 55.88,216.53 57.78,218.44 Q46.G 62.23,218.44 65.41,221.62 v69.22,221.62 | Q58.G v80.96,218.44
IN_A0_N  (via drill 0.5 pad 1.02)
  Top 0.406: v45.72,212.72 v55.24,212.72 | v80.64,209.55 79.38,209.55 71.75,215.9 v71.12,215.9
  Bottom 0.406: v45.72,212.72 41.91,208.91 Q23.G 31.75,207.01 R30.1 28.57,205.74 6.99,205.74 5.71,207.01 3.17,207.01 2.54,207.65 2.54,214.63 R269.1 | v55.24,212.72 55.24,209.55 58.42,207.01 R55.1 68.58,207.01 71.12,209.55 v71.12,215.9 | Q193.D R269.1 | R269.1 R241.1 | R75.1 87.63,208.28 81.92,208.28 v80.64,209.55
IN_A1  (via drill 0.5 pad 1.02)
  Top 0.406: v55.24,189.87 v52.07,189.87 v43.18,189.87 | v80.96,191.77 75.56,191.77 71.75,194.94 v69.85,194.94 | v53.66,230.82 53.34,230.5 33.34,230.5 29.84,234 29.84,245.43 27.94,247.33 J4.3
  Bottom 0.406: v43.18,189.87 39.37,193.68 Q35.G 33.02,194.31 29.21,194.31 28.57,194.94 26.04,194.94 25.4,194.31 19.05,194.31 17.78,195.58 7.62,195.58 Q194.G | v55.24,189.87 55.88,189.87 57.15,191.77 Q52.G 62.23,191.77 65.41,194.94 v69.85,194.94 | J1.3 47.62,8.26 53.34,13.97 53.34,182.25 52.07,183.51 v52.07,189.87 52.07,193.04 53.34,194.31 53.34,230.5 v53.66,230.82 | Q55.G v80.96,191.77
IN_A1_N  (via drill 0.5 pad 1.02)
  Top 0.406: v45.72,186.06 v55.24,186.06 | v80.64,182.88 79.06,182.88 71.75,189.23 v71.12,189.23
  Bottom 0.406: Q194.D R270.1 | R270.1 R242.1 | v45.72,186.06 41.91,182.25 Q33.G 31.75,180.34 R40.1 28.57,179.07 7.62,179.07 6.35,180.34 3.81,180.34 2.54,181.61 2.54,187.96 R270.1 | v55.24,186.06 55.24,182.88 57.78,180.34 R65.1 68.58,180.34 71.12,182.88 v71.12,189.23 | R70.1 87.63,181.61 81.92,181.61 v80.64,182.88
IN_A2  (via drill 0.5 pad 1.02)
  Top 0.406: v45.09,163.19 v52.07,163.19 v55.24,163.19 | v80.96,165.1 76.2,165.1 71.75,168.28 v69.22,168.28 | v52.7,231.78 52.39,231.14 33.66,231.14 30.48,234.31 30.48,245.75 29.21,247.01 29.21,250.19 J4.4
  Bottom 0.406: Q195.G 7.62,168.91 17.78,168.91 19.05,167.64 25.4,167.64 26.04,168.28 28.57,168.28 29.21,167.64 33.02,167.64 Q82.G 40.64,167 v45.09,163.19 | v55.24,163.19 56.52,163.19 Q143.G 62.23,165.1 66.04,168.28 v69.22,168.28 | J1.4 46.35,5.08 46.35,8.26 52.7,14.61 52.7,154.94 52.07,155.57 v52.07,163.19 52.07,165.74 52.7,166.37 52.7,181.61 50.8,183.51 50.8,193.04 52.7,194.94 v52.7,231.78 | Q146.G v80.96,165.1
IN_A2_N  (via drill 0.5 pad 1.02)
  Top 0.406: v45.72,159.38 v55.24,159.38 | v80.64,156.53 79.38,156.53 71.75,162.56 v71.12,162.56
  Bottom 0.406: v45.72,159.38 41.91,155.57 Q80.G 31.75,153.67 R95.1 28.57,152.4 7.62,152.4 6.35,153.67 3.17,153.67 2.54,154.31 2.54,161.29 R263.1 | v55.24,159.38 55.24,156.21 56.52,154.94 58.42,153.67 R160.1 67.94,153.67 71.12,156.84 v71.12,162.56 | R263.1 Q195.D | R263.1 R243.1 | R165.1 87.63,154.94 81.92,154.94 v80.64,156.53
IN_A3  (via drill 0.5 pad 1.02)
  Top 0.406: v45.09,136.53 45.72,135.89 v51.44,135.89 v55.24,135.89 | v80.96,138.43 76.2,138.43 72.39,141.6 v69.85,141.6 | v50.8,232.09 50.48,231.78 33.97,231.78 31.11,234.63 31.11,248.28 J4.5
  Bottom 0.406: Q196.G 7.62,142.24 17.78,142.24 19.05,140.97 25.4,140.97 26.04,141.6 28.57,141.6 29.21,140.97 33.02,140.97 Q92.G 41.27,140.34 v45.09,136.53 | v55.24,135.89 57.78,138.43 Q152.G 62.23,138.43 66.04,141.6 v69.85,141.6 | J1.5 45.09,8.89 50.16,13.97 50.16,20.95 52.07,22.86 52.07,32.38 50.16,34.29 50.16,48.26 52.07,50.16 52.07,59.69 50.16,61.59 50.16,74.3 52.07,76.2 52.07,86.36 50.16,88.27 50.16,100.97 52.07,102.87 52.07,113.03 50.16,114.94 50.16,128.27 51.44,129.54 v51.44,135.89 51.44,140.34 50.16,141.6 50.16,207.65 52.07,209.55 52.07,219.71 50.16,221.62 50.16,231.46 v50.8,232.09 | Q155.G v80.96,138.43
IN_A3_N  (via drill 0.5 pad 1.02)
  Top 0.406: v45.72,132.72 v55.24,132.72 | v80.33,129.54 79.06,129.54 71.75,135.89 v71.12,135.89
  Bottom 0.406: Q196.D R272.1 | R272.1 R244.1 | v45.72,132.72 45.09,132.72 41.27,128.91 Q90.G 31.75,127 R105.1 28.57,125.73 6.99,125.73 5.71,127 3.81,127 2.54,128.27 2.54,134.62 R272.1 | v55.24,132.72 55.24,129.54 55.88,128.91 58.42,127 R175.1 69.22,127 71.12,128.91 v71.12,135.89 | R180.1 87.63,128.27 81.92,128.27 v80.33,129.54
IN_A4  (via drill 0.5 pad 1.02)
  Top 0.406: v45.09,109.86 45.72,109.22 v50.8,109.22 v55.24,109.22 | v69.85,114.94 71.75,114.94 76.2,111.76 v80.96,111.76 | v49.53,232.73 49.21,232.41 34.29,232.41 31.75,234.95 31.75,250.19 J4.6
  Bottom 0.406: Q197.G 8.26,115.57 17.78,115.57 19.05,114.3 25.4,114.3 26.04,114.94 28.57,114.94 29.21,114.3 33.02,114.3 Q102.G 41.27,113.67 v45.09,109.86 | v55.24,109.22 57.78,111.76 Q161.G 61.59,111.76 66.04,114.94 v69.85,114.94 | v80.96,111.76 Q164.G | J1.6 43.81,5.08 43.81,8.89 47.62,12.7 47.62,20.95 50.8,24.13 50.8,31.11 47.62,34.29 47.62,47.62 51.44,51.44 51.44,57.15 47.62,60.96 47.62,74.93 51.44,78.11 51.44,84.45 47.62,88.27 47.62,100.97 50.8,104.14 v50.8,109.22 50.8,111.76 47.62,114.94 47.62,127.64 50.16,130.18 50.16,139.06 47.62,141.6 47.62,154.31 49.53,156.21 49.53,166.37 47.62,168.28 47.62,180.97 49.53,182.88 49.53,193.04 47.62,194.94 47.62,207.65 51.44,211.46 51.44,217.81 47.62,221.62 47.62,231.14 v49.53,232.73
IN_A4_N  (via drill 0.5 pad 1.02)
  Top 0.406: v45.72,106.05 v55.24,106.05 | v80.64,102.87 79.38,102.87 71.44,109.22 v70.48,109.22
  Bottom 0.406: Q197.D R271.1 | R271.1 R245.1 | R271.1 2.54,107.31 2.54,100.97 3.17,100.33 6.35,100.33 7.62,99.06 28.57,99.06 R115.1 31.11,100.33 33.02,102.23 Q100.G 41.91,102.23 v45.72,106.05 | v55.24,106.05 55.24,103.5 58.42,100.33 R190.1 69.22,100.33 70.48,101.6 v70.48,109.22 | R195.1 87.63,101.6 81.92,101.6 v80.64,102.87
IN_A5  (via drill 0.5 pad 1.02)
  Top 0.406: v45.09,83.19 45.72,82.55 v50.16,82.55 v55.24,82.55 | v69.22,88.27 72.39,88.27 76.2,85.09 v80.96,85.09 | v48.26,233.68 47.31,233.04 34.92,233.04 33.02,234.95 J4.7
  Bottom 0.406: Q198.G 5.08,86.36 7.62,88.9 17.78,88.9 19.05,87.63 25.4,87.63 26.04,88.27 28.57,88.27 29.21,87.63 33.02,87.63 Q112.G 41.27,87 v45.09,83.19 | v55.24,82.55 57.78,85.09 Q170.G 61.59,85.09 66.04,88.27 v69.22,88.27 | v80.96,85.09 Q173.G | J1.7 42.55,8.89 46.99,13.34 46.99,21.59 50.16,24.77 50.16,30.48 46.99,33.66 46.99,48.26 50.8,52.07 50.8,56.52 46.99,60.33 46.99,75.56 50.16,78.11 v50.16,82.55 50.16,84.45 46.99,87.63 46.99,101.6 49.53,104.14 49.53,111.76 46.99,114.3 46.99,128.27 49.53,130.81 49.53,138.43 46.99,140.97 46.99,154.94 48.9,156.84 48.9,165.74 46.99,167.64 46.99,181.61 48.9,183.51 48.9,192.41 46.99,194.31 46.99,208.28 50.8,212.09 50.8,217.17 46.99,220.98 46.99,232.41 v48.26,233.68
IN_A5_N  (via drill 0.5 pad 1.02)
  Top 0.406: v45.72,79.38 v55.24,79.38 | v80.64,76.2 79.38,76.2 71.75,82.55 v70.48,82.55
  Bottom 0.406: Q198.D R273.1 | R273.1 R246.1 | R273.1 2.54,80.64 2.54,74.3 3.17,73.66 6.35,73.66 7.62,72.39 28.57,72.39 R125.1 31.11,73.66 33.02,75.56 Q110.G 41.27,75.56 44.45,79.38 v45.72,79.38 | v55.24,79.38 55.24,76.2 55.88,75.56 58.42,73.66 R205.1 68.58,73.66 70.48,76.2 v70.48,82.55 | R210.1 87.63,74.93 81.92,74.93 v80.64,76.2
IN_A6  (via drill 0.5 pad 1.02)
  Top 0.406: v55.24,55.88 v49.53,55.88 45.09,55.88 v44.45,56.52 | v69.22,61.59 73.03,61.59 76.52,58.42 v80.96,58.42 | v46.99,234.31 46.35,233.68 35.88,233.68 34.29,235.27 34.29,250.19 J4.8
  Bottom 0.406: v44.45,56.52 40.64,60.33 Q122.G 33.02,60.96 29.21,60.96 28.57,61.59 26.04,61.59 25.4,60.96 19.05,60.96 17.78,62.23 8.26,62.23 Q199.G | v55.24,55.88 Q179.G 62.23,58.42 65.41,61.59 v69.22,61.59 | v80.96,58.42 Q182.G | J1.8 41.27,5.08 41.27,8.89 45.72,13.34 45.72,21.59 49.53,25.4 49.53,29.84 46.35,33.02 46.35,48.9 49.53,52.07 v49.53,55.88 49.53,56.52 46.35,59.69 46.35,76.2 48.9,78.11 48.9,84.45 46.35,87 46.35,102.23 48.9,104.78 48.9,111.12 46.35,113.67 46.35,128.91 48.9,131.44 48.9,137.79 46.35,140.34 46.35,155.57 48.26,157.48 48.26,165.1 46.35,167 46.35,182.25 48.26,184.15 48.26,191.77 46.35,193.68 46.35,208.91 50.16,212.72 50.16,216.53 46.35,220.34 46.35,233.68 v46.99,234.31
IN_A6_N  (via drill 0.5 pad 1.02)
  Top 0.406: v45.72,52.7 v55.24,52.7 | v80.64,49.53 79.38,49.53 71.75,55.88 v70.48,55.88
  Bottom 0.406: R274.1 2.54,53.98 2.54,48.26 3.81,46.99 6.35,46.99 7.62,45.72 28.57,45.72 R135.1 31.75,46.99 Q120.G 41.91,48.9 v45.72,52.7 | R274.1 R247.1 | R274.1 Q199.D | v55.24,52.7 55.24,49.53 57.78,46.99 R220.1 68.58,46.99 70.48,49.53 v70.48,55.88 | R225.1 87.63,48.26 82.23,48.26 v80.64,49.53
IN_A7  (via drill 0.5 pad 1.02)
  Top 0.406: v48.26,29.21 v55.24,29.21 | v69.22,34.29 72.39,34.29 75.56,31.75 v80.96,31.75 | v45.72,234.95 36.83,234.95 35.56,236.22 J4.9
  Bottom 0.406: Q200.G 7.62,35.56 17.78,35.56 19.05,34.29 26.04,34.29 26.67,34.92 29.21,34.92 29.84,34.29 33.66,34.29 Q132.G 40.64,33.66 44.45,29.84 46.99,29.84 47.62,29.21 v48.26,29.21 | v55.24,29.21 57.78,31.75 Q188.G 62.23,31.75 64.77,34.29 v69.22,34.29 | v80.96,31.75 Q191.G | J1.9 40.01,8.89 44.45,13.34 44.45,21.59 48.26,25.4 v48.26,29.21 | v48.26,29.21 48.26,29.84 45.72,32.38 45.72,49.53 48.26,52.07 48.26,56.52 45.72,59.05 45.72,76.83 48.26,78.74 48.26,83.82 45.72,86.36 45.72,102.87 48.26,105.41 48.26,110.49 45.72,113.03 45.72,129.54 48.26,132.08 48.26,137.16 45.72,139.7 45.72,156.21 47.62,158.12 47.62,164.47 45.72,166.37 45.72,182.88 47.62,184.78 47.62,191.13 45.72,193.04 45.72,209.55 49.53,213.36 49.53,215.9 45.72,219.71 v45.72,234.95
IN_A7_N  (via drill 0.5 pad 1.02)
  Top 0.406: v45.72,26.67 v55.24,26.67 | v71.12,29.21 79.38,22.86 v80.64,22.86
  Bottom 0.406: Q200.D R275.1 | R275.1 5.08,29.21 R248.1 | R275.1 2.54,27.94 2.54,21.59 3.81,20.32 6.35,20.32 7.62,19.05 29.21,19.05 R145.1 32.38,20.32 Q130.G 41.27,22.23 v45.72,26.67 | v55.24,26.67 55.24,22.86 58.42,20.32 R235.1 66.67,20.32 69.85,22.86 71.12,24.13 v71.12,29.21 | v80.64,22.86 81.92,21.59 88.27,21.59 R240.1
IN_B0  (via drill 0.5 pad 1.02)
  Top 0.406: v45.72,214 v55.24,214 | v67.31,220.34 67.94,219.07 71.75,219.07 76.2,215.26 v78.11,215.26 | J4.11 38.1,239.08 40.96,236.22 52.07,236.22 58.42,229.87 v78.74,229.87
  Bottom 0.406: Q201.G 10.16,210.19 10.16,210.82 Q22.G 29.21,210.82 29.84,211.46 42.55,211.46 45.09,214 v45.72,214 | v55.24,214 55.88,214 Q45.G 61.59,213.36 61.59,216.53 65.41,220.34 v67.31,220.34 | J2.2 102.23,5.08 102.23,8.89 96.52,14.61 81.28,14.61 77.47,18.41 77.47,131.44 79.38,133.35 79.38,137.79 77.47,139.06 77.47,156.84 78.74,159.38 78.74,163.83 77.47,165.1 77.47,184.15 78.74,186.06 78.74,189.87 77.47,191.13 77.47,214 v78.11,215.26 | Q57.G 82.55,213.36 81.28,215.26 v78.11,215.26 | v78.11,215.26 77.47,216.53 77.47,228.6 v78.74,229.87
IN_B0_N  (via drill 0.5 pad 1.02)
  Top 0.406: R29.1 28.57,220.98 Q24.G | v55.24,217.81 v44.45,217.81 | v80.96,219.71 76.83,219.71 72.39,222.88 v69.22,222.88
  Bottom 0.406: Q201.D 6.99,210.19 6.99,213.36 R262.1 7.62,217.17 R249.1 24.77,219.07 26.67,220.98 27.94,220.98 28.57,220.34 Q24.G | v55.24,217.81 55.24,219.71 57.78,222.25 R54.1 61.59,222.88 v69.22,222.88 | v44.45,217.81 40.01,222.25 R29.1 | R74.1 85.72,222.25 84.45,220.98 81.92,220.98 v80.96,219.71
IN_B1  (via drill 0.5 pad 1.02)
  Top 0.406: v45.72,187.32 v55.24,187.32 | v66.67,193.68 67.94,192.41 71.75,192.41 v77.47,187.96 v80.96,187.96 | J4.12 39.37,250.19 39.37,238.76 41.27,236.85 53.34,236.85 59.37,230.82 77.79,230.82 v78.11,231.14
  Bottom 0.406: Q202.G 10.16,184.15 Q32.G 29.21,184.15 29.84,184.78 42.55,184.78 45.09,187.32 v45.72,187.32 | v55.24,187.32 55.88,187.32 56.52,186.69 56.52,186.06 Q51.G 60.96,186.06 60.96,189.23 65.41,193.68 v66.67,193.68 | J2.3 100.97,8.89 95.89,13.97 80.64,13.97 76.83,17.78 76.83,132.08 78.74,133.99 78.74,137.16 76.83,138.43 76.83,157.48 78.11,160.02 78.11,163.19 76.83,164.47 76.83,186.06 v77.47,187.96 76.83,189.87 76.83,229.87 v78.11,231.14 | Q54.G 82.55,186.69 v80.96,187.96
IN_B1_N  (via drill 0.5 pad 1.02)
  Top 0.406: R39.1 28.57,194.31 Q34.G | v55.24,191.13 v43.81,191.13 | v80.96,193.04 76.2,193.04 71.75,196.22 v69.85,196.22
  Bottom 0.406: Q202.D 6.99,183.51 6.99,186.06 7.62,186.69 R261.1 7.62,190.5 R250.1 24.77,192.41 26.67,194.31 27.94,194.31 28.57,193.68 Q34.G | v55.24,191.13 55.24,193.04 57.78,195.58 R64.1 61.59,196.22 v69.85,196.22 | v43.81,191.13 39.37,195.58 R39.1 | R69.1 86.36,195.58 85.09,194.31 81.92,194.31 v80.96,193.04
IN_B2  (via drill 0.5 pad 1.02)
  Top 0.406: v45.72,160.66 v55.24,160.66 | v67.31,167 67.94,165.74 71.75,165.74 v76.83,161.93 79.38,161.93 v80.96,161.29 | J4.13 40.64,238.76 41.91,237.49 54.61,237.49 59.69,232.09 v77.15,232.09
  Bottom 0.406: v45.72,160.66 45.09,160.66 42.55,158.12 29.84,158.12 29.21,157.48 Q79.G 10.16,157.48 Q203.G | v55.24,160.66 56.52,160.66 57.15,160.02 57.15,158.75 Q142.G 61.59,160.02 61.59,163.19 66.04,167 v67.31,167 | J2.4 99.69,5.08 99.69,8.89 95.25,13.34 80.01,13.34 76.2,17.14 76.2,132.72 78.11,134.62 78.11,136.53 76.2,137.79 76.2,158.12 76.83,159.38 v76.83,161.93 76.2,163.83 76.2,231.46 v77.15,232.09 | Q145.G 82.55,160.02 v80.96,161.29
IN_B2_N  (via drill 0.5 pad 1.02)
  Top 0.406: R94.1 28.57,167.64 Q81.G | v55.24,164.47 v45.72,164.47 | v80.96,166.37 76.2,166.37 71.75,169.54 v69.22,169.54
  Bottom 0.406: Q203.D 6.99,156.84 6.99,159.38 7.62,160.02 R260.1 7.62,163.83 R251.1 24.77,165.74 26.67,167.64 27.94,167.64 28.57,167 Q81.G | v55.24,164.47 55.24,165.74 58.42,168.91 R159.1 61.59,169.54 v69.22,169.54 | v45.72,164.47 40.01,168.91 R94.1 | R164.1 86.36,168.91 85.09,167.64 81.92,167.64 v80.96,166.37
IN_B3  (via drill 0.5 pad 1.02)
  Top 0.406: v45.72,133.99 v55.24,133.99 | v80.96,134.62 76.83,134.62 v76.2,135.25 71.75,139.06 68.58,139.06 v67.31,140.34 | J4.14 41.91,250.19 41.91,239.4 43.18,238.12 55.88,238.12 60.64,233.04 v76.2,233.04
  Bottom 0.406: Q204.G 10.16,130.18 10.79,130.81 Q89.G 29.21,130.81 29.84,131.44 41.91,131.44 44.45,133.99 v45.72,133.99 | v55.24,133.99 56.52,133.99 57.78,132.72 57.78,132.08 Q151.G 60.96,132.72 60.96,135.89 66.04,140.34 v67.31,140.34 | J2.5 98.42,8.89 94.61,12.7 79.38,12.7 75.56,16.51 75.56,133.35 v76.2,135.25 75.56,137.16 75.56,232.41 v76.2,233.04 | Q154.G 82.55,133.35 v80.96,134.62
IN_B3_N  (via drill 0.5 pad 1.02)
  Top 0.406: R104.1 28.57,140.97 Q91.G | v80.96,139.7 76.83,139.7 73.03,142.88 v69.85,142.88 | v55.24,137.79 v45.72,137.79
  Bottom 0.406: Q204.D 6.99,130.18 6.99,133.35 R259.1 7.62,137.16 R252.1 24.77,139.06 26.67,140.97 27.94,140.97 28.57,140.34 Q91.G | R179.1 86.36,142.24 85.09,140.97 82.55,140.97 v80.96,139.7 | v69.85,142.88 61.59,142.88 R174.1 58.42,142.24 55.24,139.06 v55.24,137.79 | v45.72,137.79 41.27,142.24 R104.1
IN_B4  (via drill 0.5 pad 1.02)
  Top 0.406: v45.72,107.31 v55.24,107.31 | v80.96,107.95 76.83,107.95 v74.3,110.49 71.75,112.39 68.58,112.39 v67.31,113.67 | J4.15 43.18,240.03 44.45,238.76 57.15,238.76 61.59,234.31 v75.56,234.31
  Bottom 0.406: Q205.G 10.16,103.5 10.79,104.14 Q99.G 29.21,104.14 29.84,104.78 41.91,104.78 45.09,107.31 v45.72,107.31 | v55.24,107.31 55.88,107.31 56.52,106.68 56.52,106.05 57.15,105.41 Q160.G 60.96,106.05 60.96,109.22 66.67,113.67 v67.31,113.67 | J2.6 97.16,5.08 97.16,8.89 93.98,12.06 78.74,12.06 74.93,15.88 74.93,108.58 v74.3,110.49 74.93,112.39 74.93,233.68 v75.56,234.31 | Q163.G 82.55,106.68 v80.96,107.95
IN_B4_N  (via drill 0.5 pad 1.02)
  Top 0.406: R114.1 28.57,114.3 Q101.G | v80.96,113.03 76.2,113.03 71.75,116.2 v69.85,116.2 | v55.24,111.12 v45.72,111.12
  Bottom 0.406: Q205.D 6.99,103.5 6.99,106.05 7.62,106.68 R264.1 7.62,110.49 R253.1 24.77,112.39 26.67,114.3 27.94,114.3 28.57,113.67 Q101.G | R194.1 86.36,115.57 85.09,114.3 83.19,114.3 82.55,113.67 v80.96,113.03 | v69.85,116.2 61.59,116.2 R189.1 57.78,115.57 55.24,113.03 v55.24,111.12 | v45.72,111.12 41.27,115.57 R114.1
IN_B5  (via drill 0.5 pad 1.02)
  Top 0.406: v45.72,80.64 v55.24,80.64 | v80.96,81.28 76.83,81.28 v73.66,84.45 72.39,85.72 68.58,85.72 v67.31,87 | J4.16 44.45,250.19 44.45,240.66 45.72,239.4 58.42,239.4 62.55,235.59 v75.25,235.59
  Bottom 0.406: Q206.G 10.16,76.83 10.79,77.47 Q109.G 29.21,77.47 29.84,78.11 41.27,78.11 43.81,80.64 v45.72,80.64 | v55.24,80.64 56.52,80.64 57.15,80.01 57.15,78.74 58.42,77.47 Q169.G 61.59,80.01 61.59,83.19 66.04,87 v67.31,87 | J2.7 95.89,8.89 93.34,11.43 78.11,11.43 74.3,15.24 74.3,81.28 73.66,82.55 v73.66,84.45 74.3,86.36 74.3,107.95 73.03,109.22 73.03,111.76 74.3,113.03 74.3,234.63 v75.25,235.59 | Q172.G 82.55,80.01 v80.96,81.28
IN_B5_N  (via drill 0.5 pad 1.02)
  Top 0.406: R124.1 28.57,87.63 Q111.G | v80.96,86.36 76.52,86.36 72.39,89.53 v69.22,89.53 | v55.24,84.45 v45.72,84.45